# Altium project S7CAS-PLEIADES-CARTES-MERE_P07.PrjPcb (part 2 of 4)

## Sheet S7CAS-PLEIADES-CARTE-MERE_P07_FPGA_2.SchDoc
size Tabloid; DocumentNumber: 6; SheetNumber: 6; SheetTotal: 16; Sheet_Name: FPGA_2; Size: 11x17
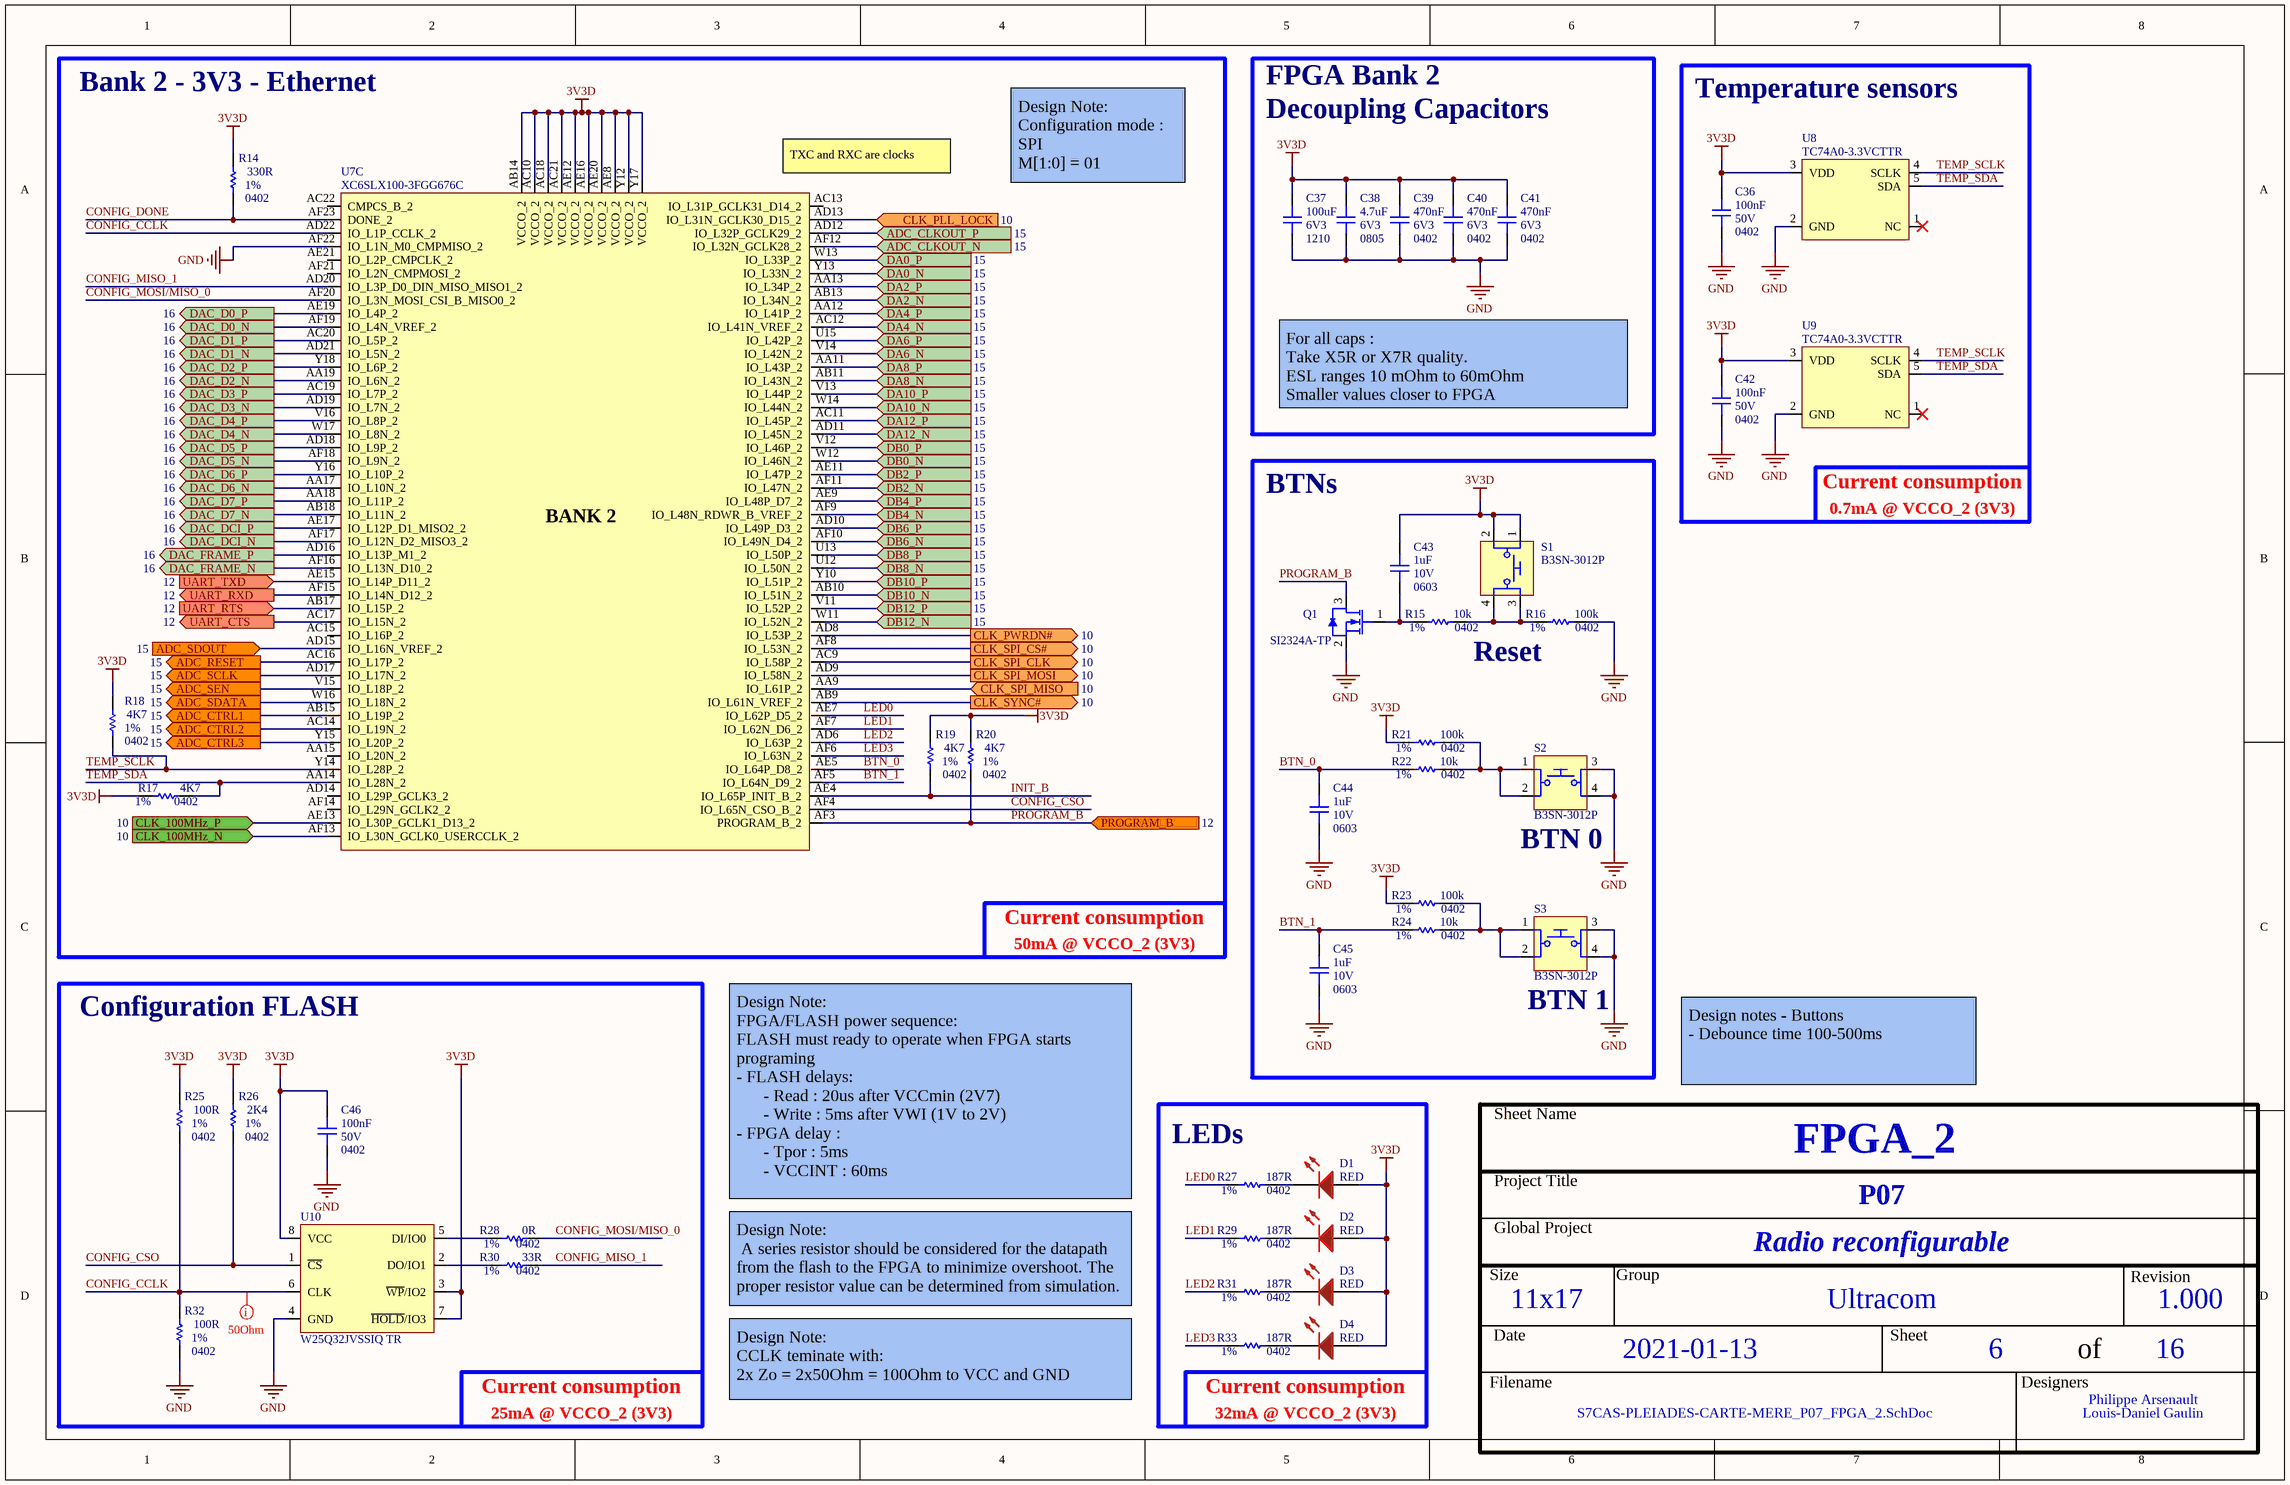
[diagram p5: S7CAS-PLEIADES-CARTE-MERE_P07_FPGA_2.SchDoc]

### Parts
C36  value 100nF  Voltage: 50V  Package: 0402  [CAP_0402]  (hidden comment: CAP - 0402)
C37  value 100uF  Voltage: 6V3  Package: 1210  [CAP_1210]  (hidden comment: CAP - 1210)
C38  value 4.7uF  Voltage: 6V3  Package: 0805  [CAP_0805]  (hidden comment: CAP - 0805)
C39  value 470nF  Voltage: 6V3  Package: 0402  [CAP_0402]  (hidden comment: CAP - 0402)
C40  value 470nF  Voltage: 6V3  Package: 0402  [CAP_0402]  (hidden comment: CAP - 0402)
C41  value 470nF  Voltage: 6V3  Package: 0402  [CAP_0402]  (hidden comment: CAP - 0402)
C42  value 100nF  Voltage: 50V  Package: 0402  [CAP_0402]  (hidden comment: CAP - 0402)
C43  value 1uF  Voltage: 10V  Package: 0603  [CAP_0603]  (hidden comment: CAP - 0603)
C44  value 1uF  Voltage: 10V  Package: 0603  [CAP_0603]  (hidden comment: CAP - 0603)
C45  value 1uF  Voltage: 10V  Package: 0603  [CAP_0603]  (hidden comment: CAP - 0603)
C46  value 100nF  Voltage: 50V  Package: 0402  [CAP_0402]  (hidden comment: CAP - 0402)
D1  value RED  [LED_0603]  (hidden comment: SML-311UTT86)
D2  value RED  [LED_0603]  (hidden comment: SML-311UTT86)
D3  value RED  [LED_0603]  (hidden comment: SML-311UTT86)
D4  value RED  [LED_0603]  (hidden comment: SML-311UTT86)
Q1  SI2324A-TP  [TRX_NMOS_SI324A-TP]
R14  value 330R  Package: 0402  Precision: 1%  [RES_0402]  (hidden comment: RES - 0402)
R15  value 10k  Package: 0402  Precision: 1%  [RES_0402]  (hidden comment: RES - 0402)
R16  value 100k  Package: 0402  Precision: 1%  [RES_0402]  (hidden comment: RES - 0402)
R17  value 4K7  Package: 0402  Precision: 1%  [RES_0402]  (hidden comment: RES - 0402)
R18  value 4K7  Package: 0402  Precision: 1%  [RES_0402]  (hidden comment: RES - 0402)
R19  value 4K7  Package: 0402  Precision: 1%  [RES_0402]  (hidden comment: RES - 0402)
R20  value 4K7  Package: 0402  Precision: 1%  [RES_0402]  (hidden comment: RES - 0402)
R21  value 100k  Package: 0402  Precision: 1%  [RES_0402]  (hidden comment: RES - 0402)
R22  value 10k  Package: 0402  Precision: 1%  [RES_0402]  (hidden comment: RES - 0402)
R23  value 100k  Package: 0402  Precision: 1%  [RES_0402]  (hidden comment: RES - 0402)
R24  value 10k  Package: 0402  Precision: 1%  [RES_0402]  (hidden comment: RES - 0402)
R25  value 100R  Package: 0402  Precision: 1%  [RES_0402]  (hidden comment: RES - 0402)
R26  value 2K4  Package: 0402  Precision: 1%  [RES_0402]  (hidden comment: RES - 0402)
R27  value 187R  Package: 0402  Precision: 1%  [RES_0402]  (hidden comment: RES - 0402)
R28  value 0R  Package: 0402  Precision: 1%  [RES_0402]  (hidden comment: RES - 0402)
R29  value 187R  Package: 0402  Precision: 1%  [RES_0402]  (hidden comment: RES - 0402)
R30  value 33R  Package: 0402  Precision: 1%  [RES_0402]  (hidden comment: RES - 0402)
R31  value 187R  Package: 0402  Precision: 1%  [RES_0402]  (hidden comment: RES - 0402)
R32  value 100R  Package: 0402  Precision: 1%  [RES_0402]  (hidden comment: RES - 0402)
R33  value 187R  Package: 0402  Precision: 1%  [RES_0402]  (hidden comment: RES - 0402)
S1  B3SN-3012P  [SWI_TACT_B3SN-3012P]
S2  B3SN-3012P  [SWI_TACT_B3SN-3012P]
S3  B3SN-3012P  [SWI_TACT_B3SN-3012P]
U7  XC6SLX100-3FGG676C  [FPGA_XILINX_FGG676]  (part C of 10)
U8  TC74A0-3.3VCTTR  [SEN_TEMP_TC74A0-3.3VCTTR]
U9  TC74A0-3.3VCTTR  [SEN_TEMP_TC74A0-3.3VCTTR]
U10  W25Q32JVSSIQ TR  [MEM_FLASH_W25Q32JVSSIQ TR]

### Blocks framed on the sheet
Bank 2 - 3V3 - Ethernet: R14 R17-R20 U7
Temperature sensors: C36 C42 U8 U9
Configuration FLASH: C46 R25 R26 R28 R30 R32 U10
LEDs: D1-D4 R27 R29 R31 R33

### Ports
ADC_CLKOUT_N (in, see 15), ADC_CLKOUT_P (in, see 15), ADC_CTRL1 (out, see 15), ADC_CTRL2 (out, see 15), ADC_CTRL3 (out, see 15), ADC_RESET (out, see 15), ADC_SCLK (out, see 15), ADC_SDATA (out, see 15), ADC_SDOUT (in, see 15), ADC_SEN (out, see 15), CLK_100MHz_N (in, see 10), CLK_100MHz_P (in, see 10), CLK_PLL_LOCK (in, see 10), CLK_PWRDN# (out, see 10), CLK_SPI_CLK (out, see 10), CLK_SPI_CS# (out, see 10), CLK_SPI_MISO (in, see 10), CLK_SPI_MOSI (out, see 10), CLK_SYNC# (out, see 10), DA0_N (in, see 15), DA0_P (in, see 15), DA2_N (in, see 15), DA2_P (in, see 15), DA4_N (in, see 15), DA4_P (in, see 15), DA6_N (in, see 15), DA6_P (in, see 15), DA8_N (in, see 15), DA8_P (in, see 15), DA10_N (in, see 15), DA10_P (in, see 15), DA12_N (in, see 15), DA12_P (in, see 15), DAC_D0_N (out, see 16), DAC_D0_P (out, see 16), DAC_D1_N (out, see 16), DAC_D1_P (out, see 16), DAC_D2_N (out, see 16), DAC_D2_P (out, see 16), DAC_D3_N (out, see 16), DAC_D3_P (out, see 16), DAC_D4_N (out, see 16), DAC_D4_P (out, see 16), DAC_D5_N (out, see 16), DAC_D5_P (out, see 16), DAC_D6_N (out, see 16), DAC_D6_P (out, see 16), DAC_D7_N (out, see 16), DAC_D7_P (out, see 16), DAC_DCI_N (out, see 16), DAC_DCI_P (out, see 16), DAC_FRAME_N (out, see 16), DAC_FRAME_P (out, see 16), DB0_N (in, see 15), DB0_P (in, see 15), DB2_N (in, see 15), DB2_P (in, see 15), DB4_N (in, see 15), DB4_P (in, see 15), DB6_N (in, see 15), DB6_P (in, see 15), DB8_N (in, see 15), DB8_P (in, see 15), DB10_N (in, see 15), DB10_P (in, see 15), DB12_N (in, see 15), DB12_P (in, see 15), PROGRAM_B (in, see 12), UART_CTS (out, see 12), UART_RTS (in, see 12), UART_RXD (out, see 12), UART_TXD (in, see 12)

### Nets
3V3D: C36.2 C37.2 C38.2 C39.2 C40.2 C41.2 C42.2 C43.2 C46.2 D1.A D2.A D3.A D4.A R14.2 R17.1 R18.2 R19.2 R20.2 R21.1 R23.1 R25.2 R26.2 S1.1 S1.2 U7.AB14(VCCO_2) U7.AC10(VCCO_2) U7.AC18(VCCO_2) U7.AC21(VCCO_2) U7.AE8(VCCO_2) U7.AE12(VCCO_2) U7.AE16(VCCO_2) U7.AE20(VCCO_2) U7.Y12(VCCO_2) U7.Y17(VCCO_2) U8.3(VDD) U9.3(VDD) U10.3(~{WP}/IO2) U10.7(~{HOLD}/IO3) U10.8(VCC)
GND: C36.1 C37.1 C38.1 C39.1 C40.1 C41.1 C42.1 C44.1 C45.1 C46.1 Q1.2(S) R16.2 R32.1 S2.3 S2.4 S3.3 S3.4 U7.AF22(IO_L1N_M0_CMPMISO_2) U8.2(GND) U9.2(GND) U10.4(GND)
ADC_CLKOUT_N: U7.AF12(IO_L32N_GCLK28_2) ; port ADC_CLKOUT_N
ADC_CLKOUT_P: U7.AD12(IO_L32P_GCLK29_2) ; port ADC_CLKOUT_P
ADC_CTRL1: U7.AB15(IO_L19P_2) ; port ADC_CTRL1
ADC_CTRL2: U7.AC14(IO_L19N_2) ; port ADC_CTRL2
ADC_CTRL3: U7.Y15(IO_L20P_2) ; port ADC_CTRL3
ADC_RESET: U7.AC16(IO_L17P_2) ; port ADC_RESET
ADC_SCLK: U7.AD17(IO_L17N_2) ; port ADC_SCLK
ADC_SDATA: U7.W16(IO_L18N_2) ; port ADC_SDATA
ADC_SDOUT: U7.AD15(IO_L16N_VREF_2) ; port ADC_SDOUT
ADC_SEN: U7.V15(IO_L18P_2) ; port ADC_SEN
BTN_0: C44.2 R22.1 U7.AE5(IO_L64P_D8_2)
BTN_1: C45.2 R24.1 U7.AF5(IO_L64N_D9_2)
CLK_100MHz_N: U7.AF13(IO_L30N_GCLK0_USERCCLK_2) ; port CLK_100MHz_N
CLK_100MHz_P: U7.AE13(IO_L30P_GCLK1_D13_2) ; port CLK_100MHz_P
CLK_PLL_LOCK: U7.AD13(IO_L31N_GCLK30_D15_2) ; port CLK_PLL_LOCK
CLK_PWRDN#: U7.AD8(IO_L53P_2) ; port CLK_PWRDN#
CLK_SPI_CLK: U7.AC9(IO_L58P_2) ; port CLK_SPI_CLK
CLK_SPI_CS#: U7.AF8(IO_L53N_2) ; port CLK_SPI_CS#
CLK_SPI_MISO: U7.AA9(IO_L61P_2) ; port CLK_SPI_MISO
CLK_SPI_MOSI: U7.AD9(IO_L58N_2) ; port CLK_SPI_MOSI
CLK_SYNC#: U7.AB9(IO_L61N_VREF_2) ; port CLK_SYNC#
CONFIG_CCLK: R25.1 R32.2 U7.AD22(IO_L1P_CCLK_2) U10.6(CLK)
CONFIG_CSO: R26.1 U7.AF4(IO_L65N_CSO_B_2) U10.1(~{CS})
CONFIG_DONE: R14.1 U7.AF23(DONE_2)
CONFIG_MISO_1: R30.1 U7.AD20(IO_L3P_D0_DIN_MISO_MISO1_2)
CONFIG_MOSI/MISO_0: R28.1 U7.AF20(IO_L3N_MOSI_CSI_B_MISO0_2)
DA0_N: U7.Y13(IO_L33N_2) ; port DA0_N
DA0_P: U7.W13(IO_L33P_2) ; port DA0_P
DA2_N: U7.AB13(IO_L34N_2) ; port DA2_N
DA2_P: U7.AA13(IO_L34P_2) ; port DA2_P
DA4_N: U7.AC12(IO_L41N_VREF_2) ; port DA4_N
DA4_P: U7.AA12(IO_L41P_2) ; port DA4_P
DA6_N: U7.V14(IO_L42N_2) ; port DA6_N
DA6_P: U7.U15(IO_L42P_2) ; port DA6_P
DA8_N: U7.AB11(IO_L43N_2) ; port DA8_N
DA8_P: U7.AA11(IO_L43P_2) ; port DA8_P
DA10_N: U7.W14(IO_L44N_2) ; port DA10_N
DA10_P: U7.V13(IO_L44P_2) ; port DA10_P
DA12_N: U7.AD11(IO_L45N_2) ; port DA12_N
DA12_P: U7.AC11(IO_L45P_2) ; port DA12_P
DAC_D0_N: U7.AF19(IO_L4N_VREF_2) ; port DAC_D0_N
DAC_D0_P: U7.AE19(IO_L4P_2) ; port DAC_D0_P
DAC_D1_N: U7.AD21(IO_L5N_2) ; port DAC_D1_N
DAC_D1_P: U7.AC20(IO_L5P_2) ; port DAC_D1_P
DAC_D2_N: U7.AA19(IO_L6N_2) ; port DAC_D2_N
DAC_D2_P: U7.Y18(IO_L6P_2) ; port DAC_D2_P
DAC_D3_N: U7.AD19(IO_L7N_2) ; port DAC_D3_N
DAC_D3_P: U7.AC19(IO_L7P_2) ; port DAC_D3_P
DAC_D4_N: U7.W17(IO_L8N_2) ; port DAC_D4_N
DAC_D4_P: U7.V16(IO_L8P_2) ; port DAC_D4_P
DAC_D5_N: U7.AF18(IO_L9N_2) ; port DAC_D5_N
DAC_D5_P: U7.AD18(IO_L9P_2) ; port DAC_D5_P
DAC_D6_N: U7.AA17(IO_L10N_2) ; port DAC_D6_N
DAC_D6_P: U7.Y16(IO_L10P_2) ; port DAC_D6_P
DAC_D7_N: U7.AB18(IO_L11N_2) ; port DAC_D7_N
DAC_D7_P: U7.AA18(IO_L11P_2) ; port DAC_D7_P
DAC_DCI_N: U7.AF17(IO_L12N_D2_MISO3_2) ; port DAC_DCI_N
DAC_DCI_P: U7.AE17(IO_L12P_D1_MISO2_2) ; port DAC_DCI_P
DAC_FRAME_N: U7.AF16(IO_L13N_D10_2) ; port DAC_FRAME_N
DAC_FRAME_P: U7.AD16(IO_L13P_M1_2) ; port DAC_FRAME_P
DB0_N: U7.W12(IO_L46N_2) ; port DB0_N
DB0_P: U7.V12(IO_L46P_2) ; port DB0_P
DB2_N: U7.AF11(IO_L47N_2) ; port DB2_N
DB2_P: U7.AE11(IO_L47P_2) ; port DB2_P
DB4_N: U7.AF9(IO_L48N_RDWR_B_VREF_2) ; port DB4_N
DB4_P: U7.AE9(IO_L48P_D7_2) ; port DB4_P
DB6_N: U7.AF10(IO_L49N_D4_2) ; port DB6_N
DB6_P: U7.AD10(IO_L49P_D3_2) ; port DB6_P
DB8_N: U7.U12(IO_L50N_2) ; port DB8_N
DB8_P: U7.U13(IO_L50P_2) ; port DB8_P
DB10_N: U7.AB10(IO_L51N_2) ; port DB10_N
DB10_P: U7.Y10(IO_L51P_2) ; port DB10_P
DB12_N: U7.W11(IO_L52N_2) ; port DB12_N
DB12_P: U7.V11(IO_L52P_2) ; port DB12_P
INIT_B: R19.1 U7.AE4(IO_L65P_INIT_B_2)
LED0: R27.1 U7.AE7(IO_L62P_D5_2)
LED1: R29.1 U7.AF7(IO_L62N_D6_2)
LED2: R31.1 U7.AD6(IO_L63P_2)
LED3: R33.1 U7.AF6(IO_L63N_2)
PROGRAM_B: Q1.3(D) R20.1 U7.AF3(PROGRAM_B_2) ; port PROGRAM_B
TEMP_SCLK: R18.1 U7.Y14(IO_L28P_2) U8.4(SCLK) U9.4(SCLK)
TEMP_SDA: R17.2 U7.AA14(IO_L28N_2) U8.5(SDA) U9.5(SDA)
UART_CTS: U7.AC17(IO_L15N_2) ; port UART_CTS
UART_RTS: U7.AB17(IO_L15P_2) ; port UART_RTS
UART_RXD: U7.AF15(IO_L14N_D12_2) ; port UART_RXD
UART_TXD: U7.AE15(IO_L14P_D11_2) ; port UART_TXD
NetC43_1: C43.1 Q1.1(G) R15.1
NetD1_K: D1.K R27.2
NetD2_K: D2.K R29.2
NetD3_K: D3.K R31.2
NetD4_K: D4.K R33.2
NetR15_2: R15.2 R16.1 S1.3 S1.4
NetR21_2: R21.2 R22.2 S2.1 S2.2
NetR23_2: R23.2 R24.2 S3.1 S3.2
NetR28_2: R28.2 U10.5(DI/IO0)
NetR30_2: R30.2 U10.2(DO/IO1)

Not connected (* = marked no-connect by the designer): U7 AA15(IO_L20N_2) AC13(IO_L31P_GCLK31_D14_2) AC15(IO_L16P_2) AC22(CMPCS_B_2) AD14(IO_L29P_GCLK3_2) AE21(IO_L2P_CMPCLK_2) AF14(IO_L29N_GCLK2_2) AF21(IO_L2N_CMPMOSI_2); U8 1(NC)*; U9 1(NC)*

### Layout directives
net class SE_50Ohm: CONFIG_CCLK

### Notes on the sheet
- FPGA Bank 2
- (near U7) TXC and RXC are clocks
- Decoupling Capacitors
- Design Note:
  Configuration mode : SPI
  M[1:0] = 01
- For all caps :
  Take X5R or X7R quality.
  ESL ranges 10 mOhm to 60mOhm
  Smaller values closer to FPGA
- BTNs
- Current consumption
- 0.7mA @ VCCO_2 (3V3)
- Reset
- (near S2) BTN 0
- 50mA @ VCCO_2 (3V3)
- (near S3) BTN 1
- Design notes - Buttons
  - Debounce time 100-500ms
- Design Note:
  FPGA/FLASH power sequence:
  FLASH must ready to operate when FPGA starts programing
  - FLASH delays:
  - Read : 20us after VCCmin (2V7)
  - Write : 5ms after VWI (1V to 2V)
  - FPGA delay :
  - Tpor : 5ms
  - VCCINT : 60ms
- Design Note:
  A series resistor should be considered for the datapath from the flash to the FPGA to minimize overshoot. The proper resistor value can be determined from simulation.
- 25mA @ VCCO_2 (3V3)
- Design Note:
  CCLK teminate with:
  2x Zo = 2x50Ohm = 100Ohm to VCC and GND
- 32mA @ VCCO_2 (3V3)
- Sheet Name
- Project Title
- Global Project
- Size
- Group
- Revision
- Date
- Sheet
- of
- Filename
- Designers
- (in symbol FPGA_XC6SLX100-3FGG676C, part C) BANK 2

### Library data of the parts
C36 C39-C42 C46 = CAP - 0402: Precision: 10%; Current: *; CreatedBy: Jonathan Bouchard; Power: *
C37 = CAP - 1210: Precision: 10%; Current: *; CreatedBy: Jonathan Bouchard; Power: *
C38 = CAP - 0805: Precision: 10%; Current: *; CreatedBy: Jonathan Bouchard; Power: *
C43-C45 = CAP - 0603: Precision: 10%; Current: *; CreatedBy: Jonathan Bouchard; Power: *
D1-D4 = LED_SML-311UTT86: LED - 620nM RED 2mA - 0603; Voltage: 1.8V; Mfg: ROHM Semiconductor; Power: 44mW; Current: 2mA; HelpURL: http://media.digikey.com/pdf/Data%20Sheets/Rohm%20PDFs/SML-311%20Series.pdf; CreatedBy: Jonathan Bouchard; Temperature: -30°C to 85°C; Package: 0603; Precision: *; Mfg Part Number: SML-311UTT86; Supplier 1: Digikey; Supplier Part Number 1: 511-1304-1-ND
Q1 = TRX_NMOS_SI2324A-TP: TRX - MOSFET N-CH 100V 2A - SOT-23; Manufacturer #1: Micro Commercial Co; Power Max: 350mW; Voltage rating: 100V (Vds max), 2V (Vgs @ 250uA); Polarized: Yes; Magnetic Material: UNKNOWN; Current Rating: 2A; Manufacturer #2: *; Value: *; Part Number #1: SI2324A-TP; Part Number #2: *; HelpURL: https://www.mccsemi.com/pdf/Products/SI2324A(SOT-23)-A.pdf; Supplier 1: Digi-Key; Supplier Part Number 1: SI2324A-TPMSCT-ND; Assembly Type: SMD; Temperature: -55°C ~ 150°C (TJ); Package: SOT-23; CreatedBy/Date: *; GRAMS Lib Spec: *; Tolerance: *; VerifiedBy: *; Cryo: *
R14-R33 = RES - 0402: Voltage: 50V; Power: 1/16W; Current: *; CreatedBy: Jonathan Bouchard
S1-S3 = SWI_TACT_B3SN-3012P_1: SWI - SWITCH TACTILE SPST-NO 0.05A 24V -SMD; Manufacturer #1: Omron Electronics Inc-EMC Div; Current Rating: 50mA; Voltage rating: 24VDC; Polarized: No; Magnetic Material: UNKNOWN; GRAMS Lib Spec: 2.8; Manufacturer #2: *; Power Max: *; Value: SPST-NO; Part Number #1: B3SN-3012P; Part Number #2: *; HelpURL: http://omronfs.omron.com/en_US/ecb/products/pdf/en-b3sn.pdf; Supplier 1: Digi-Key; Supplier Part Number 1: SW261CT-ND; Assembly Type: SMD; Temperature: -25°C ~ 70°C; Package: SMD; CreatedBy/Date: Olivier Bernard / 5/12/2017; Tolerance: *; VerifiedBy: Caroline Paulin / 11 juillet 2018; Cryo: UNKNOWN
U7 = FPGA_XC6SLX100-3FGG676C: as U7 on sheet S7CAS-PLEIADES-CARTE-MERE_P07_FPGA_0; Current: *; Power: *; Mfg: Xilinx; Mfg Part Number: XC6SLX100-3FGG676C; HelpURL: https://www.xilinx.com/support/documentation/data_sheets/ds162.pdf; CreatedBy: Jonathan Bouchard; Temperature: 0°C ~ 85°C (TJ); Value: *; Precision: *; Package: BGA-676; Supplier 1: Digikey; Supplier Part Number 1: 122-1760-ND
U8 U9 = SENS_TEMP_TC74A0-3.3VCTTR: SENS - TEMPERATURE SENSOR I2C/SMBUS - SOT23-5; Voltage: 2.7 V ~ 5.5 V; Mfg: Microchip; Precision: ±2°C (±3°C); Current: *; Power: *; Mfg Part Number: TC74A0-3.3VCTTR; HelpURL: http://ww1.microchip.com/downloads/en/DeviceDoc/21462D.pdf; CreatedBy: Jonathan Bouchard; Temperature: -40°C ~ 125°C; Value: *; Package: SOT23-5; Supplier 1: Digikey; Supplier Part Number 1: TC74A0-3.3VCTDKR-ND
U10 = MEM_FLASH_W25Q32JVSSIQ TR: MEM - FLASH NOR 32Mb 133MHZ - 8-SOIC; Voltage: 2.7 V ~ 3.6 V; Mfg: Winbond Electronics; Current: *; Power: *; Mfg Part Number: W25Q32JVSSIQ TR; HelpURL: https://www.winbond.com/resource-files/w25q32jv%20revg%2003272018%20plus.pdf; CreatedBy: Louis-Daniel Gaulin; Temperature: -40°C ~ 85°C (TA); Value: *; Precision: *; Package: 8-SOIC; Supplier Part Number 1: W25Q32JVSSIQCT-ND; Supplier 1: Digikey

## Sheet S7CAS-PLEIADES-CARTE-MERE_P07_FPGA_3.SchDoc
size Tabloid; DocumentNumber: 7; SheetNumber: 7; SheetTotal: 16; Sheet_Name: FPGA_3; Size: 11x17
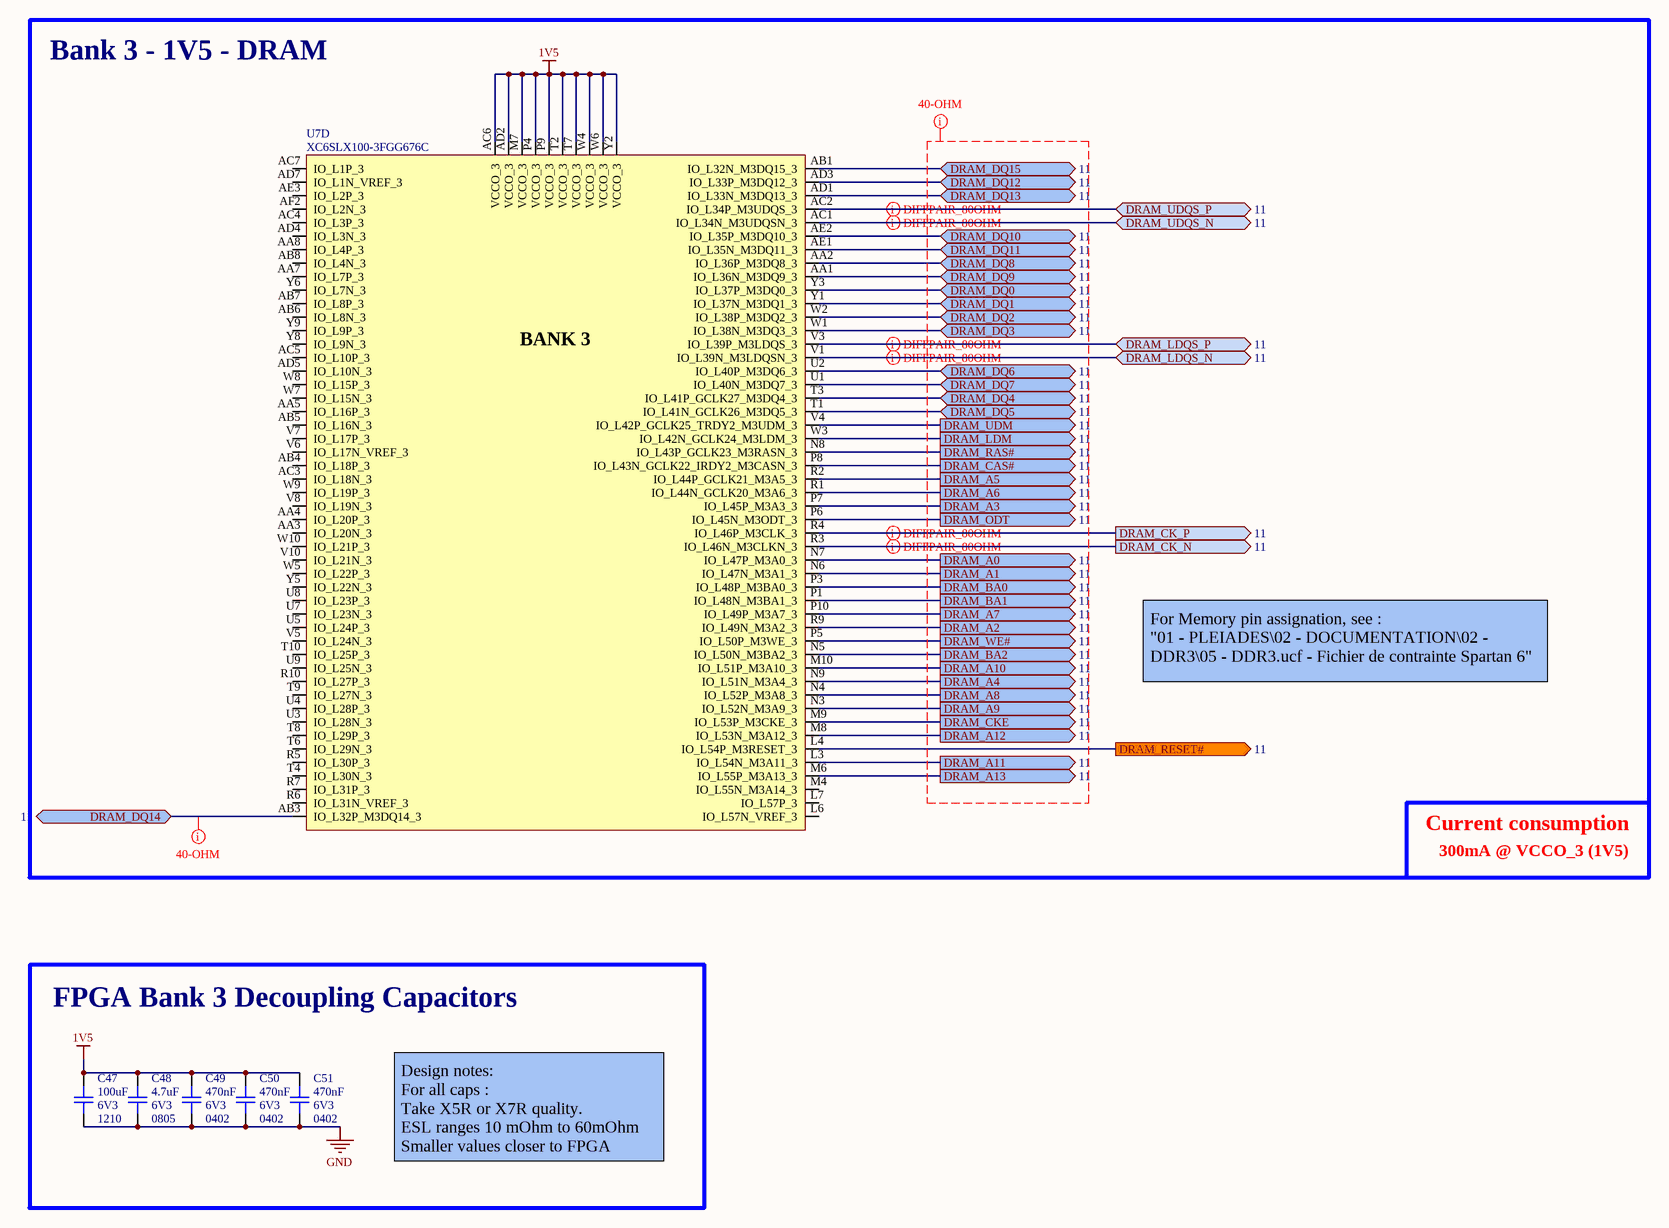
[diagram p6: S7CAS-PLEIADES-CARTE-MERE_P07_FPGA_3.SchDoc]

### Parts
C47  value 100uF  Voltage: 6V3  Package: 1210  [CAP_1210]  (hidden comment: CAP - 1210)
C48  value 4.7uF  Voltage: 6V3  Package: 0805  [CAP_0805]  (hidden comment: CAP - 0805)
C49  value 470nF  Voltage: 6V3  Package: 0402  [CAP_0402]  (hidden comment: CAP - 0402)
C50  value 470nF  Voltage: 6V3  Package: 0402  [CAP_0402]  (hidden comment: CAP - 0402)
C51  value 470nF  Voltage: 6V3  Package: 0402  [CAP_0402]  (hidden comment: CAP - 0402)
U7  XC6SLX100-3FGG676C  [FPGA_XILINX_FGG676]  (part D of 10)

### Blocks framed on the sheet
Bank 3 - 1V5 - DRAM: U7
FPGA Bank 3 Decoupling Capacitors: C47-C51

### Ports
DRAM_A0 (out, see 11), DRAM_A1 (out, see 11), DRAM_A2 (out, see 11), DRAM_A3 (out, see 11), DRAM_A4 (out, see 11), DRAM_A5 (out, see 11), DRAM_A6 (out, see 11), DRAM_A7 (out, see 11), DRAM_A8 (out, see 11), DRAM_A9 (out, see 11), DRAM_A10 (out, see 11), DRAM_A11 (out, see 11), DRAM_A12 (out, see 11), DRAM_A13 (out, see 11), DRAM_BA0 (out, see 11), DRAM_BA1 (out, see 11), DRAM_BA2 (out, see 11), DRAM_CAS# (out, see 11), DRAM_CK_N (out, see 11), DRAM_CK_P (out, see 11), DRAM_CKE (out, see 11), DRAM_DQ0 (bidir, see 11), DRAM_DQ1 (bidir, see 11), DRAM_DQ2 (bidir, see 11), DRAM_DQ3 (bidir, see 11), DRAM_DQ4 (bidir, see 11), DRAM_DQ5 (bidir, see 11), DRAM_DQ6 (bidir, see 11), DRAM_DQ7 (bidir, see 11), DRAM_DQ8 (bidir, see 11), DRAM_DQ9 (bidir, see 11), DRAM_DQ10 (bidir, see 11), DRAM_DQ11 (bidir, see 11), DRAM_DQ12 (bidir, see 11), DRAM_DQ13 (bidir, see 11), DRAM_DQ14 (bidir, see 11), DRAM_DQ15 (bidir, see 11), DRAM_LDM (out, see 11), DRAM_LDQS_N (bidir, see 11), DRAM_LDQS_P (bidir, see 11), DRAM_ODT (out, see 11), DRAM_RAS# (out, see 11), DRAM_RESET# (out, see 11), DRAM_UDM (out, see 11), DRAM_UDQS_N (bidir, see 11), DRAM_UDQS_P (bidir, see 11), DRAM_WE# (out, see 11)

### Nets
1V5: C47.2 C48.2 C49.2 C50.2 C51.2 U7.AC6(VCCO_3) U7.AD2(VCCO_3) U7.M7(VCCO_3) U7.P4(VCCO_3) U7.P9(VCCO_3) U7.T2(VCCO_3) U7.T7(VCCO_3) U7.W4(VCCO_3) U7.W6(VCCO_3) U7.Y2(VCCO_3)
GND: C47.1 C48.1 C49.1 C50.1 C51.1
DRAM_A0: U7.N7(IO_L47P_M3A0_3) ; port DRAM_A0
DRAM_A1: U7.N6(IO_L47N_M3A1_3) ; port DRAM_A1
DRAM_A2: U7.R9(IO_L49N_M3A2_3) ; port DRAM_A2
DRAM_A3: U7.P7(IO_L45P_M3A3_3) ; port DRAM_A3
DRAM_A4: U7.N9(IO_L51N_M3A4_3) ; port DRAM_A4
DRAM_A5: U7.R2(IO_L44P_GCLK21_M3A5_3) ; port DRAM_A5
DRAM_A6: U7.R1(IO_L44N_GCLK20_M3A6_3) ; port DRAM_A6
DRAM_A7: U7.P10(IO_L49P_M3A7_3) ; port DRAM_A7
DRAM_A8: U7.N4(IO_L52P_M3A8_3) ; port DRAM_A8
DRAM_A9: U7.N3(IO_L52N_M3A9_3) ; port DRAM_A9
DRAM_A10: U7.M10(IO_L51P_M3A10_3) ; port DRAM_A10
DRAM_A11: U7.L3(IO_L54N_M3A11_3) ; port DRAM_A11
DRAM_A12: U7.M8(IO_L53N_M3A12_3) ; port DRAM_A12
DRAM_A13: U7.M6(IO_L55P_M3A13_3) ; port DRAM_A13
DRAM_BA0: U7.P3(IO_L48P_M3BA0_3) ; port DRAM_BA0
DRAM_BA1: U7.P1(IO_L48N_M3BA1_3) ; port DRAM_BA1
DRAM_BA2: U7.N5(IO_L50N_M3BA2_3) ; port DRAM_BA2
DRAM_CAS#: U7.P8(IO_L43N_GCLK22_IRDY2_M3CASN_3) ; port DRAM_CAS#
DRAM_CK_N: U7.R3(IO_L46N_M3CLKN_3) ; port DRAM_CK_N
DRAM_CK_P: U7.R4(IO_L46P_M3CLK_3) ; port DRAM_CK_P
DRAM_CKE: U7.M9(IO_L53P_M3CKE_3) ; port DRAM_CKE
DRAM_DQ0: U7.Y3(IO_L37P_M3DQ0_3) ; port DRAM_DQ0
DRAM_DQ1: U7.Y1(IO_L37N_M3DQ1_3) ; port DRAM_DQ1
DRAM_DQ2: U7.W2(IO_L38P_M3DQ2_3) ; port DRAM_DQ2
DRAM_DQ3: U7.W1(IO_L38N_M3DQ3_3) ; port DRAM_DQ3
DRAM_DQ4: U7.T3(IO_L41P_GCLK27_M3DQ4_3) ; port DRAM_DQ4
DRAM_DQ5: U7.T1(IO_L41N_GCLK26_M3DQ5_3) ; port DRAM_DQ5
DRAM_DQ6: U7.U2(IO_L40P_M3DQ6_3) ; port DRAM_DQ6
DRAM_DQ7: U7.U1(IO_L40N_M3DQ7_3) ; port DRAM_DQ7
DRAM_DQ8: U7.AA2(IO_L36P_M3DQ8_3) ; port DRAM_DQ8
DRAM_DQ9: U7.AA1(IO_L36N_M3DQ9_3) ; port DRAM_DQ9
DRAM_DQ10: U7.AE2(IO_L35P_M3DQ10_3) ; port DRAM_DQ10
DRAM_DQ11: U7.AE1(IO_L35N_M3DQ11_3) ; port DRAM_DQ11
DRAM_DQ12: U7.AD3(IO_L33P_M3DQ12_3) ; port DRAM_DQ12
DRAM_DQ13: U7.AD1(IO_L33N_M3DQ13_3) ; port DRAM_DQ13
DRAM_DQ14: U7.AB3(IO_L32P_M3DQ14_3) ; port DRAM_DQ14
DRAM_DQ15: U7.AB1(IO_L32N_M3DQ15_3) ; port DRAM_DQ15
DRAM_LDM: U7.W3(IO_L42N_GCLK24_M3LDM_3) ; port DRAM_LDM
DRAM_LDQS_N: U7.V1(IO_L39N_M3LDQSN_3) ; port DRAM_LDQS_N
DRAM_LDQS_P: U7.V3(IO_L39P_M3LDQS_3) ; port DRAM_LDQS_P
DRAM_ODT: U7.P6(IO_L45N_M3ODT_3) ; port DRAM_ODT
DRAM_RAS#: U7.N8(IO_L43P_GCLK23_M3RASN_3) ; port DRAM_RAS#
DRAM_RESET#: U7.L4(IO_L54P_M3RESET_3) ; port DRAM_RESET#
DRAM_UDM: U7.V4(IO_L42P_GCLK25_TRDY2_M3UDM_3) ; port DRAM_UDM
DRAM_UDQS_N: U7.AC1(IO_L34N_M3UDQSN_3) ; port DRAM_UDQS_N
DRAM_UDQS_P: U7.AC2(IO_L34P_M3UDQS_3) ; port DRAM_UDQS_P
DRAM_WE#: U7.P5(IO_L50P_M3WE_3) ; port DRAM_WE#

Not connected (* = marked no-connect by the designer): U7 AA3(IO_L20N_3) AA4(IO_L20P_3) AA5(IO_L16P_3) AA7(IO_L7P_3) AA8(IO_L4P_3) AB4(IO_L18P_3) AB5(IO_L16N_3) AB6(IO_L8N_3) AB7(IO_L8P_3) AB8(IO_L4N_3) AC3(IO_L18N_3) AC4(IO_L3P_3) AC5(IO_L10P_3) AC7(IO_L1P_3) AD4(IO_L3N_3) AD5(IO_L10N_3) AD7(IO_L1N_VREF_3) AE3(IO_L2P_3) AF2(IO_L2N_3) L6(IO_L57N_VREF_3) L7(IO_L57P_3) M4(IO_L55N_M3A14_3) R5(IO_L30P_3) R6(IO_L31N_VREF_3) R7(IO_L31P_3) R10(IO_L27P_3) T4(IO_L30N_3) T6(IO_L29N_3) T8(IO_L29P_3) T9(IO_L27N_3) T10(IO_L25P_3) U3(IO_L28N_3) U4(IO_L28P_3) U5(IO_L24P_3) U7(IO_L23N_3) U8(IO_L23P_3) U9(IO_L25N_3) V5(IO_L24N_3) V6(IO_L17N_VREF_3) V7(IO_L17P_3) V8(IO_L19N_3) V10(IO_L21N_3) W5(IO_L22P_3) W7(IO_L15N_3) W8(IO_L15P_3) W9(IO_L19P_3) W10(IO_L21P_3) Y5(IO_L22N_3) Y6(IO_L7N_3) Y8(IO_L9N_3) Y9(IO_L9P_3)

### Layout directives
differential pair; differential pair class DIFF_80_OHM: DRAM_CK_N, DRAM_CK_P, DRAM_LDQS_N, DRAM_LDQS_P, DRAM_UDQS_N, DRAM_UDQS_P
net class SE_40OHM: (no net found under the mark), DRAM_DQ14

### Notes on the sheet
- For Memory pin assignation, see :
  "01 - PLEIADES\02 - DOCUMENTATION\02 - DDR3\05 - DDR3.ucf - Fichier de contrainte Spartan 6"
- Current consumption
- 300mA @ VCCO_3 (1V5)
- Design notes:
  For all caps :
  Take X5R or X7R quality.
  ESL ranges 10 mOhm to 60mOhm
  Smaller values closer to FPGA
- Sheet Name
- Project Title
- Global Project
- Size
- Group
- Revision
- Date
- Sheet
- of
- Filename
- Designers
- (in symbol FPGA_XC6SLX100-3FGG676C, part D) BANK 3

### Library data of the parts
C47 = CAP - 1210: Precision: 10%; Current: *; CreatedBy: Jonathan Bouchard; Power: *
C48 = CAP - 0805: Precision: 10%; Current: *; CreatedBy: Jonathan Bouchard; Power: *
C49-C51 = CAP - 0402: Precision: 10%; Current: *; CreatedBy: Jonathan Bouchard; Power: *
U7 = FPGA_XC6SLX100-3FGG676C: FPGA - XILINX SPARTAN 6 480 I/O - BGA-676; Voltage: 1.14 V ~ 1.26 V; Current: *; Power: *; Mfg: Xilinx; Mfg Part Number: XC6SLX100-3FGG676C; HelpURL: https://www.xilinx.com/support/documentation/data_sheets/ds162.pdf; CreatedBy: Jonathan Bouchard; Temperature: 0°C ~ 85°C (TJ); Value: *; Precision: *; Package: BGA-676; Supplier 1: Digikey; Supplier Part Number 1: 122-1760-ND

## Sheet S7CAS-PLEIADES-CARTE-MERE_P07_FPGA_4-5.SchDoc
size Tabloid; DocumentNumber: 8; SheetNumber: 8; SheetTotal: 16; Sheet_Name: FPGA_4; Size: 11x17
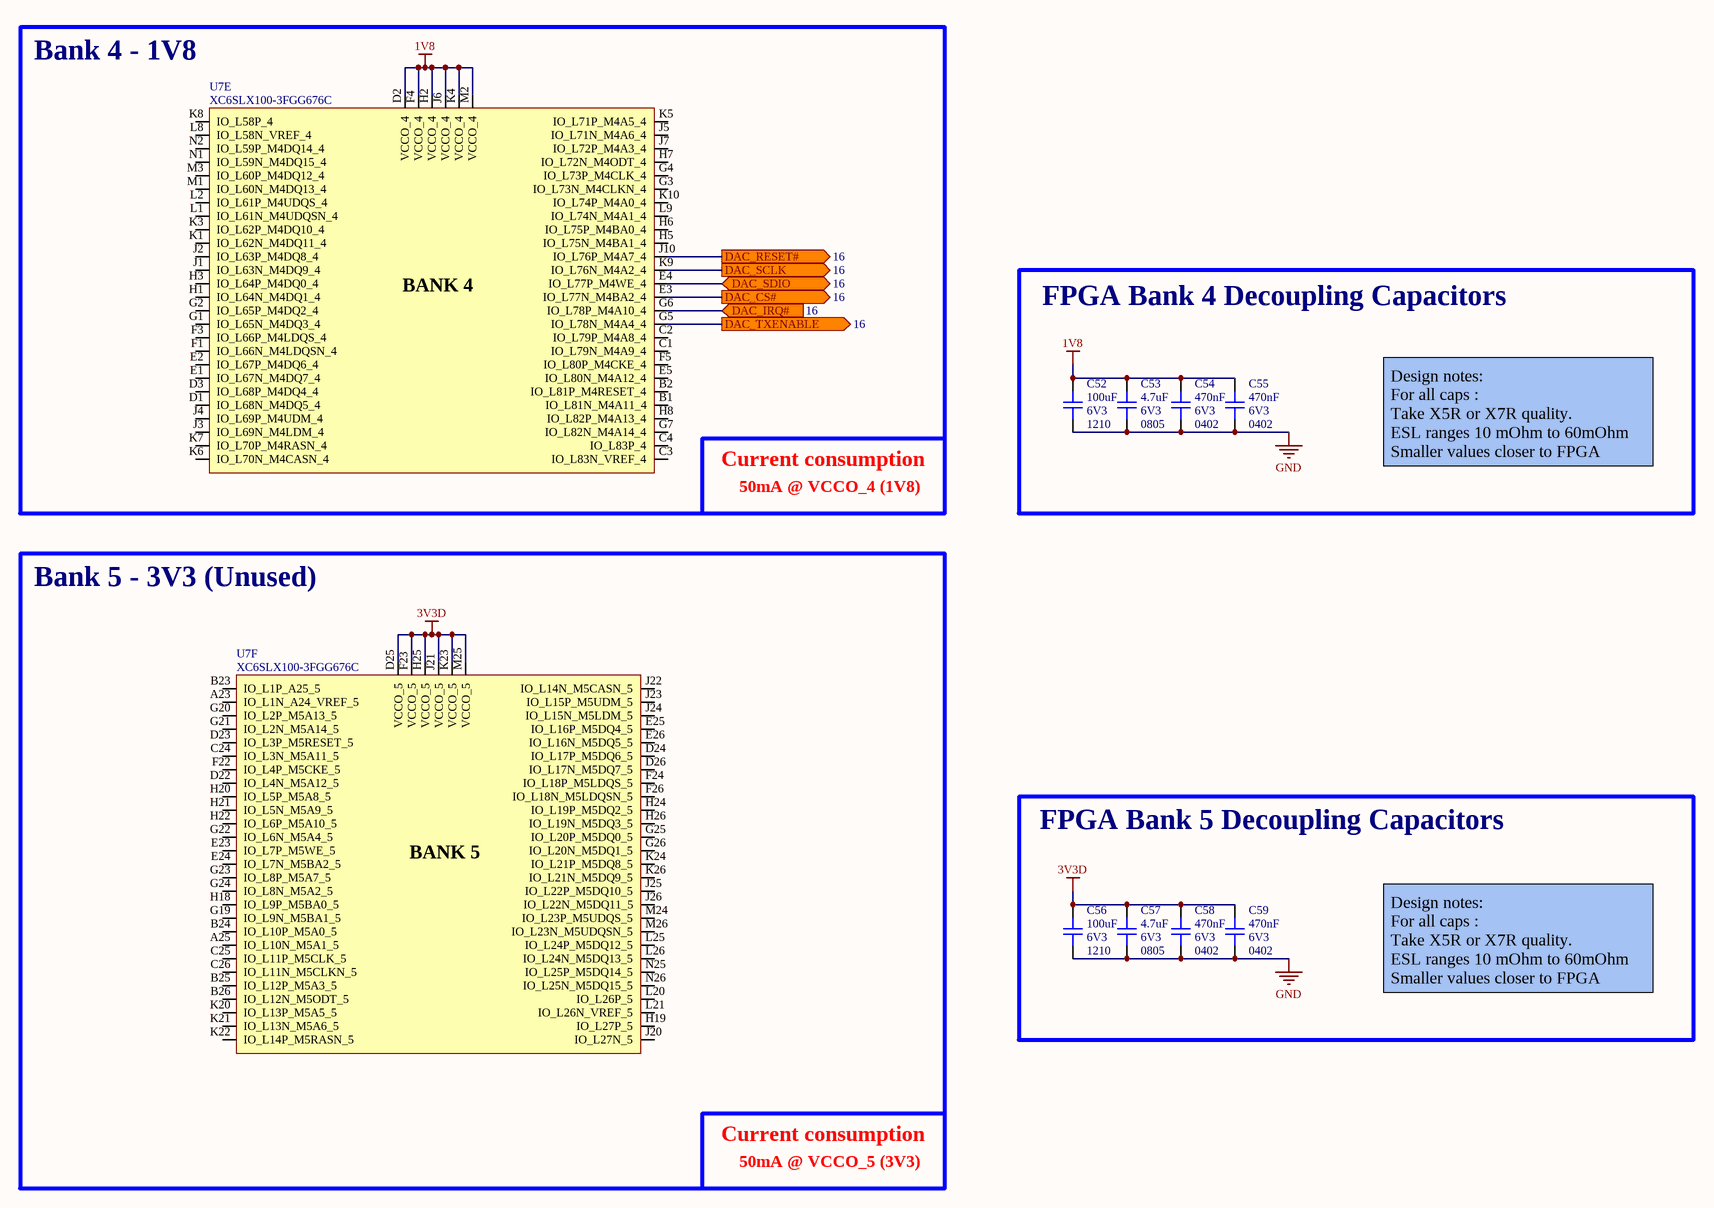
[diagram p7: S7CAS-PLEIADES-CARTE-MERE_P07_FPGA_4-5.SchDoc]

### Parts
C52  value 100uF  Voltage: 6V3  Package: 1210  [CAP_1210]  (hidden comment: CAP - 1210)
C53  value 4.7uF  Voltage: 6V3  Package: 0805  [CAP_0805]  (hidden comment: CAP - 0805)
C54  value 470nF  Voltage: 6V3  Package: 0402  [CAP_0402]  (hidden comment: CAP - 0402)
C55  value 470nF  Voltage: 6V3  Package: 0402  [CAP_0402]  (hidden comment: CAP - 0402)
C56  value 100uF  Voltage: 6V3  Package: 1210  [CAP_1210]  (hidden comment: CAP - 1210)
C57  value 4.7uF  Voltage: 6V3  Package: 0805  [CAP_0805]  (hidden comment: CAP - 0805)
C58  value 470nF  Voltage: 6V3  Package: 0402  [CAP_0402]  (hidden comment: CAP - 0402)
C59  value 470nF  Voltage: 6V3  Package: 0402  [CAP_0402]  (hidden comment: CAP - 0402)
U7  XC6SLX100-3FGG676C  [FPGA_XILINX_FGG676]  (parts E,F of 10)

### Blocks framed on the sheet
Bank 4 - 1V8: U7
FPGA Bank 4 Decoupling Capacitors: C52-C55
Bank 5 - 3V3 (Unused): U7
FPGA Bank 5 Decoupling Capacitors: C56-C59

### Ports
DAC_CS# (out, see 16), DAC_IRQ# (in, see 16), DAC_RESET# (out, see 16), DAC_SCLK (out, see 16), DAC_SDIO (bidir, see 16), DAC_TXENABLE (out, see 16)

### Nets
1V8: C52.2 C53.2 C54.2 C55.2 U7.D2(VCCO_4) U7.F4(VCCO_4) U7.H2(VCCO_4) U7.J6(VCCO_4) U7.K4(VCCO_4) U7.M2(VCCO_4)
3V3D: C56.2 C57.2 C58.2 C59.2 U7.D25(VCCO_5) U7.F23(VCCO_5) U7.H25(VCCO_5) U7.J21(VCCO_5) U7.K23(VCCO_5) U7.M25(VCCO_5)
GND: C52.1 C53.1 C54.1 C55.1 C56.1 C57.1 C58.1 C59.1
DAC_CS#: U7.E3(IO_L77N_M4BA2_4) ; port DAC_CS#
DAC_IRQ#: U7.G6(IO_L78P_M4A10_4) ; port DAC_IRQ#
DAC_RESET#: U7.J10(IO_L76P_M4A7_4) ; port DAC_RESET#
DAC_SCLK: U7.K9(IO_L76N_M4A2_4) ; port DAC_SCLK
DAC_SDIO: U7.E4(IO_L77P_M4WE_4) ; port DAC_SDIO
DAC_TXENABLE: U7.G5(IO_L78N_M4A4_4) ; port DAC_TXENABLE

Not connected (* = marked no-connect by the designer): U7 A23(IO_L1N_A24_VREF_5) A25(IO_L10N_M5A1_5) B1(IO_L81N_M4A11_4) B2(IO_L81P_M4RESET_4) B23(IO_L1P_A25_5) B24(IO_L10P_M5A0_5) B25(IO_L12P_M5A3_5) B26(IO_L12N_M5ODT_5) C1(IO_L79N_M4A9_4) C2(IO_L79P_M4A8_4) C3(IO_L83N_VREF_4) C4(IO_L83P_4) C24(IO_L3N_M5A11_5) C25(IO_L11P_M5CLK_5) C26(IO_L11N_M5CLKN_5) D1(IO_L68N_M4DQ5_4) D3(IO_L68P_M4DQ4_4) D22(IO_L4N_M5A12_5) D23(IO_L3P_M5RESET_5) D24(IO_L17P_M5DQ6_5) D26(IO_L17N_M5DQ7_5) E1(IO_L67N_M4DQ7_4) E2(IO_L67P_M4DQ6_4) E5(IO_L80N_M4A12_4) E23(IO_L7P_M5WE_5) E24(IO_L7N_M5BA2_5) E25(IO_L16P_M5DQ4_5) E26(IO_L16N_M5DQ5_5) F1(IO_L66N_M4LDQSN_4) F3(IO_L66P_M4LDQS_4) F5(IO_L80P_M4CKE_4) F22(IO_L4P_M5CKE_5) F24(IO_L18P_M5LDQS_5) F26(IO_L18N_M5LDQSN_5) G1(IO_L65N_M4DQ3_4) G2(IO_L65P_M4DQ2_4) G3(IO_L73N_M4CLKN_4) G4(IO_L73P_M4CLK_4) G7(IO_L82N_M4A14_4) G19(IO_L9N_M5BA1_5) G20(IO_L2P_M5A13_5) G21(IO_L2N_M5A14_5) G22(IO_L6N_M5A4_5) G23(IO_L8P_M5A7_5) G24(IO_L8N_M5A2_5) G25(IO_L20P_M5DQ0_5) G26(IO_L20N_M5DQ1_5) H1(IO_L64N_M4DQ1_4) H3(IO_L64P_M4DQ0_4) H5(IO_L75N_M4BA1_4) H6(IO_L75P_M4BA0_4) H7(IO_L72N_M4ODT_4) H8(IO_L82P_M4A13_4) H18(IO_L9P_M5BA0_5) H19(IO_L27P_5) H20(IO_L5P_M5A8_5) H21(IO_L5N_M5A9_5) H22(IO_L6P_M5A10_5) H24(IO_L19P_M5DQ2_5) H26(IO_L19N_M5DQ3_5) J1(IO_L63N_M4DQ9_4) J2(IO_L63P_M4DQ8_4) J3(IO_L69N_M4LDM_4) J4(IO_L69P_M4UDM_4) J5(IO_L71N_M4A6_4) J7(IO_L72P_M4A3_4) J20(IO_L27N_5) J22(IO_L14N_M5CASN_5) J23(IO_L15P_M5UDM_5) J24(IO_L15N_M5LDM_5) J25(IO_L22P_M5DQ10_5) J26(IO_L22N_M5DQ11_5) K1(IO_L62N_M4DQ11_4) K3(IO_L62P_M4DQ10_4) K5(IO_L71P_M4A5_4) K6(IO_L70N_M4CASN_4) K7(IO_L70P_M4RASN_4) K8(IO_L58P_4) K10(IO_L74P_M4A0_4) K20(IO_L13P_M5A5_5) K21(IO_L13N_M5A6_5) K22(IO_L14P_M5RASN_5) K24(IO_L21P_M5DQ8_5) K26(IO_L21N_M5DQ9_5) L1(IO_L61N_M4UDQSN_4) L2(IO_L61P_M4UDQS_4) L8(IO_L58N_VREF_4) L9(IO_L74N_M4A1_4) L20(IO_L26P_5) L21(IO_L26N_VREF_5) L25(IO_L24P_M5DQ12_5) L26(IO_L24N_M5DQ13_5) M1(IO_L60N_M4DQ13_4) M3(IO_L60P_M4DQ12_4) M24(IO_L23P_M5UDQS_5) M26(IO_L23N_M5UDQSN_5) N1(IO_L59N_M4DQ15_4) N2(IO_L59P_M4DQ14_4) N25(IO_L25P_M5DQ14_5) N26(IO_L25N_M5DQ15_5)

### Notes on the sheet
- Current consumption
- Design notes:
  For all caps :
  Take X5R or X7R quality.
  ESL ranges 10 mOhm to 60mOhm
  Smaller values closer to FPGA
- 50mA @ VCCO_4 (1V8)
- 50mA @ VCCO_5 (3V3)
- Sheet Name
- Project Title
- Global Project
- Size
- Group
- Revision
- Date
- Sheet
- of
- Filename
- Designers
- (in symbol FPGA_XC6SLX100-3FGG676C, part E) BANK 4
- (in symbol FPGA_XC6SLX100-3FGG676C, part F) BANK 5

### Library data of the parts
C52 C56 = CAP - 1210: Precision: 10%; Current: *; CreatedBy: Jonathan Bouchard; Power: *
C53 C57 = CAP - 0805: Precision: 10%; Current: *; CreatedBy: Jonathan Bouchard; Power: *
C54 C55 C58 C59 = CAP - 0402: Precision: 10%; Current: *; CreatedBy: Jonathan Bouchard; Power: *
U7 = FPGA_XC6SLX100-3FGG676C: as U7 on sheet S7CAS-PLEIADES-CARTE-MERE_P07_FPGA_3; Current: *; Power: *; Mfg: Xilinx; Mfg Part Number: XC6SLX100-3FGG676C; HelpURL: https://www.xilinx.com/support/documentation/data_sheets/ds162.pdf; CreatedBy: Jonathan Bouchard; Temperature: 0°C ~ 85°C (TJ); Value: *; Precision: *; Package: BGA-676; Supplier 1: Digikey; Supplier Part Number 1: 122-1760-ND

## Sheet S7CAS-PLEIADES-CARTE-MERE_P07_FPGA_MISC.SchDoc
size Tabloid; DocumentNumber: 9; SheetNumber: 9; SheetTotal: 16; Sheet_Name: FPGA_MISC; Size: 11x17
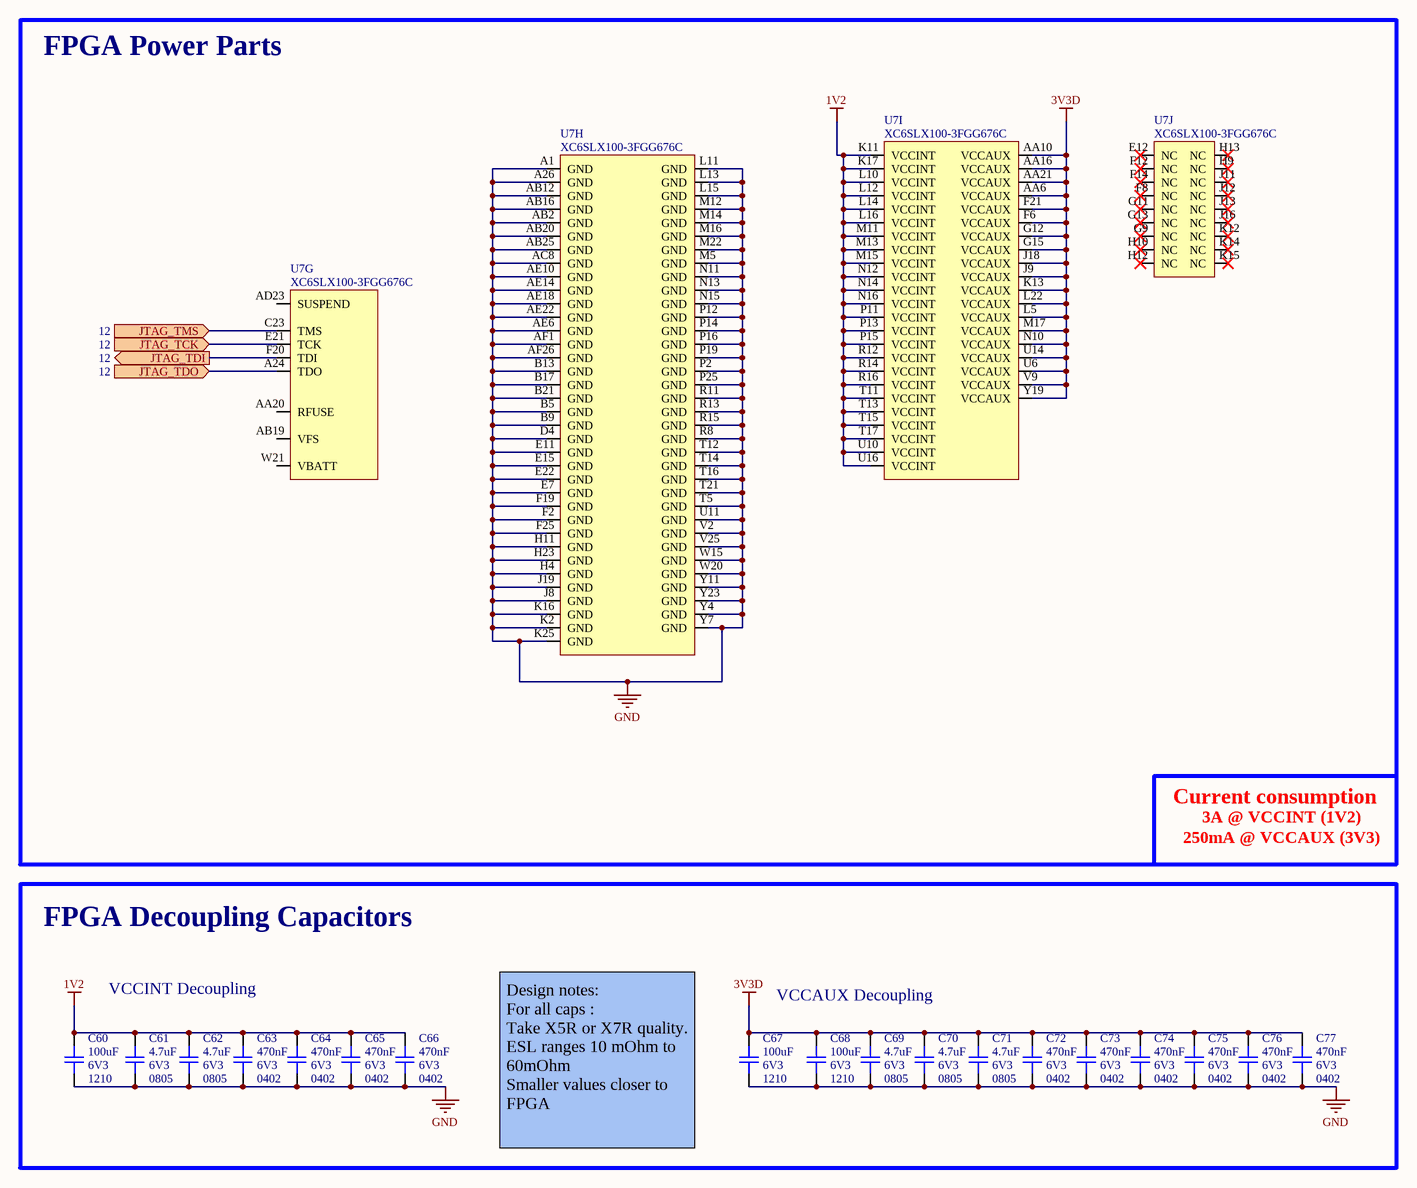
[diagram p8: S7CAS-PLEIADES-CARTE-MERE_P07_FPGA_MISC.SchDoc]

### Parts
C60  value 100uF  Voltage: 6V3  Package: 1210  [CAP_1210]  (hidden comment: CAP - 1210)
C61  value 4.7uF  Voltage: 6V3  Package: 0805  [CAP_0805]  (hidden comment: CAP - 0805)
C62  value 4.7uF  Voltage: 6V3  Package: 0805  [CAP_0805]  (hidden comment: CAP - 0805)
C63  value 470nF  Voltage: 6V3  Package: 0402  [CAP_0402]  (hidden comment: CAP - 0402)
C64  value 470nF  Voltage: 6V3  Package: 0402  [CAP_0402]  (hidden comment: CAP - 0402)
C65  value 470nF  Voltage: 6V3  Package: 0402  [CAP_0402]  (hidden comment: CAP - 0402)
C66  value 470nF  Voltage: 6V3  Package: 0402  [CAP_0402]  (hidden comment: CAP - 0402)
C67  value 100uF  Voltage: 6V3  Package: 1210  [CAP_1210]  (hidden comment: CAP - 1210)
C68  value 100uF  Voltage: 6V3  Package: 1210  [CAP_1210]  (hidden comment: CAP - 1210)
C69  value 4.7uF  Voltage: 6V3  Package: 0805  [CAP_0805]  (hidden comment: CAP - 0805)
C70  value 4.7uF  Voltage: 6V3  Package: 0805  [CAP_0805]  (hidden comment: CAP - 0805)
C71  value 4.7uF  Voltage: 6V3  Package: 0805  [CAP_0805]  (hidden comment: CAP - 0805)
C72  value 470nF  Voltage: 6V3  Package: 0402  [CAP_0402]  (hidden comment: CAP - 0402)
C73  value 470nF  Voltage: 6V3  Package: 0402  [CAP_0402]  (hidden comment: CAP - 0402)
C74  value 470nF  Voltage: 6V3  Package: 0402  [CAP_0402]  (hidden comment: CAP - 0402)
C75  value 470nF  Voltage: 6V3  Package: 0402  [CAP_0402]  (hidden comment: CAP - 0402)
C76  value 470nF  Voltage: 6V3  Package: 0402  [CAP_0402]  (hidden comment: CAP - 0402)
C77  value 470nF  Voltage: 6V3  Package: 0402  [CAP_0402]  (hidden comment: CAP - 0402)
U7  XC6SLX100-3FGG676C  [FPGA_XILINX_FGG676]  (parts G,H,I,J of 10)

### Blocks framed on the sheet
FPGA Power Parts: U7
FPGA Decoupling Capacitors: C60-C77

### Ports
JTAG_TCK (in, see 12), JTAG_TDI (out, see 12), JTAG_TDO (in, see 12), JTAG_TMS (in, see 12)

### Nets
1V2: C60.2 C61.2 C62.2 C63.2 C64.2 C65.2 C66.2 U7.K11(VCCINT) U7.K17(VCCINT) U7.L10(VCCINT) U7.L12(VCCINT) U7.L14(VCCINT) U7.L16(VCCINT) U7.M11(VCCINT) U7.M13(VCCINT) U7.M15(VCCINT) U7.N12(VCCINT) U7.N14(VCCINT) U7.N16(VCCINT) U7.P11(VCCINT) U7.P13(VCCINT) U7.P15(VCCINT) U7.R12(VCCINT) U7.R14(VCCINT) U7.R16(VCCINT) U7.T11(VCCINT) U7.T13(VCCINT) U7.T15(VCCINT) U7.T17(VCCINT) U7.U10(VCCINT) U7.U16(VCCINT)
3V3D: C67.2 C68.2 C69.2 C70.2 C71.2 C72.2 C73.2 C74.2 C75.2 C76.2 C77.2 U7.AA6(VCCAUX) U7.AA10(VCCAUX) U7.AA16(VCCAUX) U7.AA21(VCCAUX) U7.F6(VCCAUX) U7.F21(VCCAUX) U7.G12(VCCAUX) U7.G15(VCCAUX) U7.J9(VCCAUX) U7.J18(VCCAUX) U7.K13(VCCAUX) U7.L5(VCCAUX) U7.L22(VCCAUX) U7.M17(VCCAUX) U7.N10(VCCAUX) U7.U6(VCCAUX) U7.U14(VCCAUX) U7.V9(VCCAUX) U7.Y19(VCCAUX)
GND: C60.1 C61.1 C62.1 C63.1 C64.1 C65.1 C66.1 C67.1 C68.1 C69.1 C70.1 C71.1 C72.1 C73.1 C74.1 C75.1 C76.1 C77.1 U7.A1(GND) U7.A26(GND) U7.AB2(GND) U7.AB12(GND) U7.AB16(GND) U7.AB20(GND) U7.AB25(GND) U7.AC8(GND) U7.AE6(GND) U7.AE10(GND) U7.AE14(GND) U7.AE18(GND) U7.AE22(GND) U7.AF1(GND) U7.AF26(GND) U7.B5(GND) U7.B9(GND) U7.B13(GND) U7.B17(GND) U7.B21(GND) U7.D4(GND) U7.E7(GND) U7.E11(GND) U7.E15(GND) U7.E22(GND) U7.F2(GND) U7.F19(GND) U7.F25(GND) U7.H4(GND) U7.H11(GND) U7.H23(GND) U7.J8(GND) U7.J19(GND) U7.K2(GND) U7.K16(GND) U7.K25(GND) U7.L11(GND) U7.L13(GND) U7.L15(GND) U7.M5(GND) U7.M12(GND) U7.M14(GND) U7.M16(GND) U7.M22(GND) U7.N11(GND) U7.N13(GND) U7.N15(GND) U7.P2(GND) U7.P12(GND) U7.P14(GND) U7.P16(GND) U7.P19(GND) U7.P25(GND) U7.R8(GND) U7.R11(GND) U7.R13(GND) U7.R15(GND) U7.T5(GND) U7.T12(GND) U7.T14(GND) U7.T16(GND) U7.T21(GND) U7.U11(GND) U7.V2(GND) U7.V25(GND) U7.W15(GND) U7.W20(GND) U7.Y4(GND) U7.Y7(GND) U7.Y11(GND) U7.Y23(GND)
JTAG_TCK: U7.E21(TCK) ; port JTAG_TCK
JTAG_TDI: U7.F20(TDI) ; port JTAG_TDI
JTAG_TDO: U7.A24(TDO) ; port JTAG_TDO
JTAG_TMS: U7.C23(TMS) ; port JTAG_TMS

Not connected (* = marked no-connect by the designer): U7 AA20(RFUSE) AB19(VFS) AD23(SUSPEND) E12(NC)* F8(NC)* F12(NC)* F14(NC)* G9(NC)* G11(NC)* G13(NC)* H9(NC)* H10(NC)* H12(NC)* H13(NC)* J11(NC)* J12(NC)* J13(NC)* J16(NC)* K12(NC)* K14(NC)* K15(NC)* W21(VBATT)

### Notes on the sheet
- Current consumption
- 3A @ VCCINT (1V2)
- 250mA @ VCCAUX (3V3)
- VCCINT Decoupling
- VCCAUX Decoupling
- Design notes:
  For all caps :
  Take X5R or X7R quality.
  ESL ranges 10 mOhm to 60mOhm
  Smaller values closer to FPGA
- Sheet Name
- Project Title
- Global Project
- Size
- Group
- Revision
- Date
- Sheet
- of
- Filename
- Designers

### Library data of the parts
C60 C67 C68 = CAP - 1210: Precision: 10%; Current: *; CreatedBy: Jonathan Bouchard; Power: *
C61 C62 C69-C71 = CAP - 0805: Precision: 10%; Current: *; CreatedBy: Jonathan Bouchard; Power: *
C63-C66 C72-C77 = CAP - 0402: Precision: 10%; Current: *; CreatedBy: Jonathan Bouchard; Power: *
U7 = FPGA_XC6SLX100-3FGG676C: as U7 on sheet S7CAS-PLEIADES-CARTE-MERE_P07_FPGA_3; Current: *; Power: *; Mfg: Xilinx; Mfg Part Number: XC6SLX100-3FGG676C; HelpURL: https://www.xilinx.com/support/documentation/data_sheets/ds162.pdf; CreatedBy: Jonathan Bouchard; Temperature: 0°C ~ 85°C (TJ); Value: *; Precision: *; Package: BGA-676; Supplier 1: Digikey; Supplier Part Number 1: 122-1760-ND

## Sheet S7CAS-PLEIADES-CARTE-MERE_P07_CLOCK.SchDoc
size Tabloid; DocumentNumber: 10; SheetNumber: 10; SheetTotal: 16; Sheet_Name: CLOCK; Size: 11x17
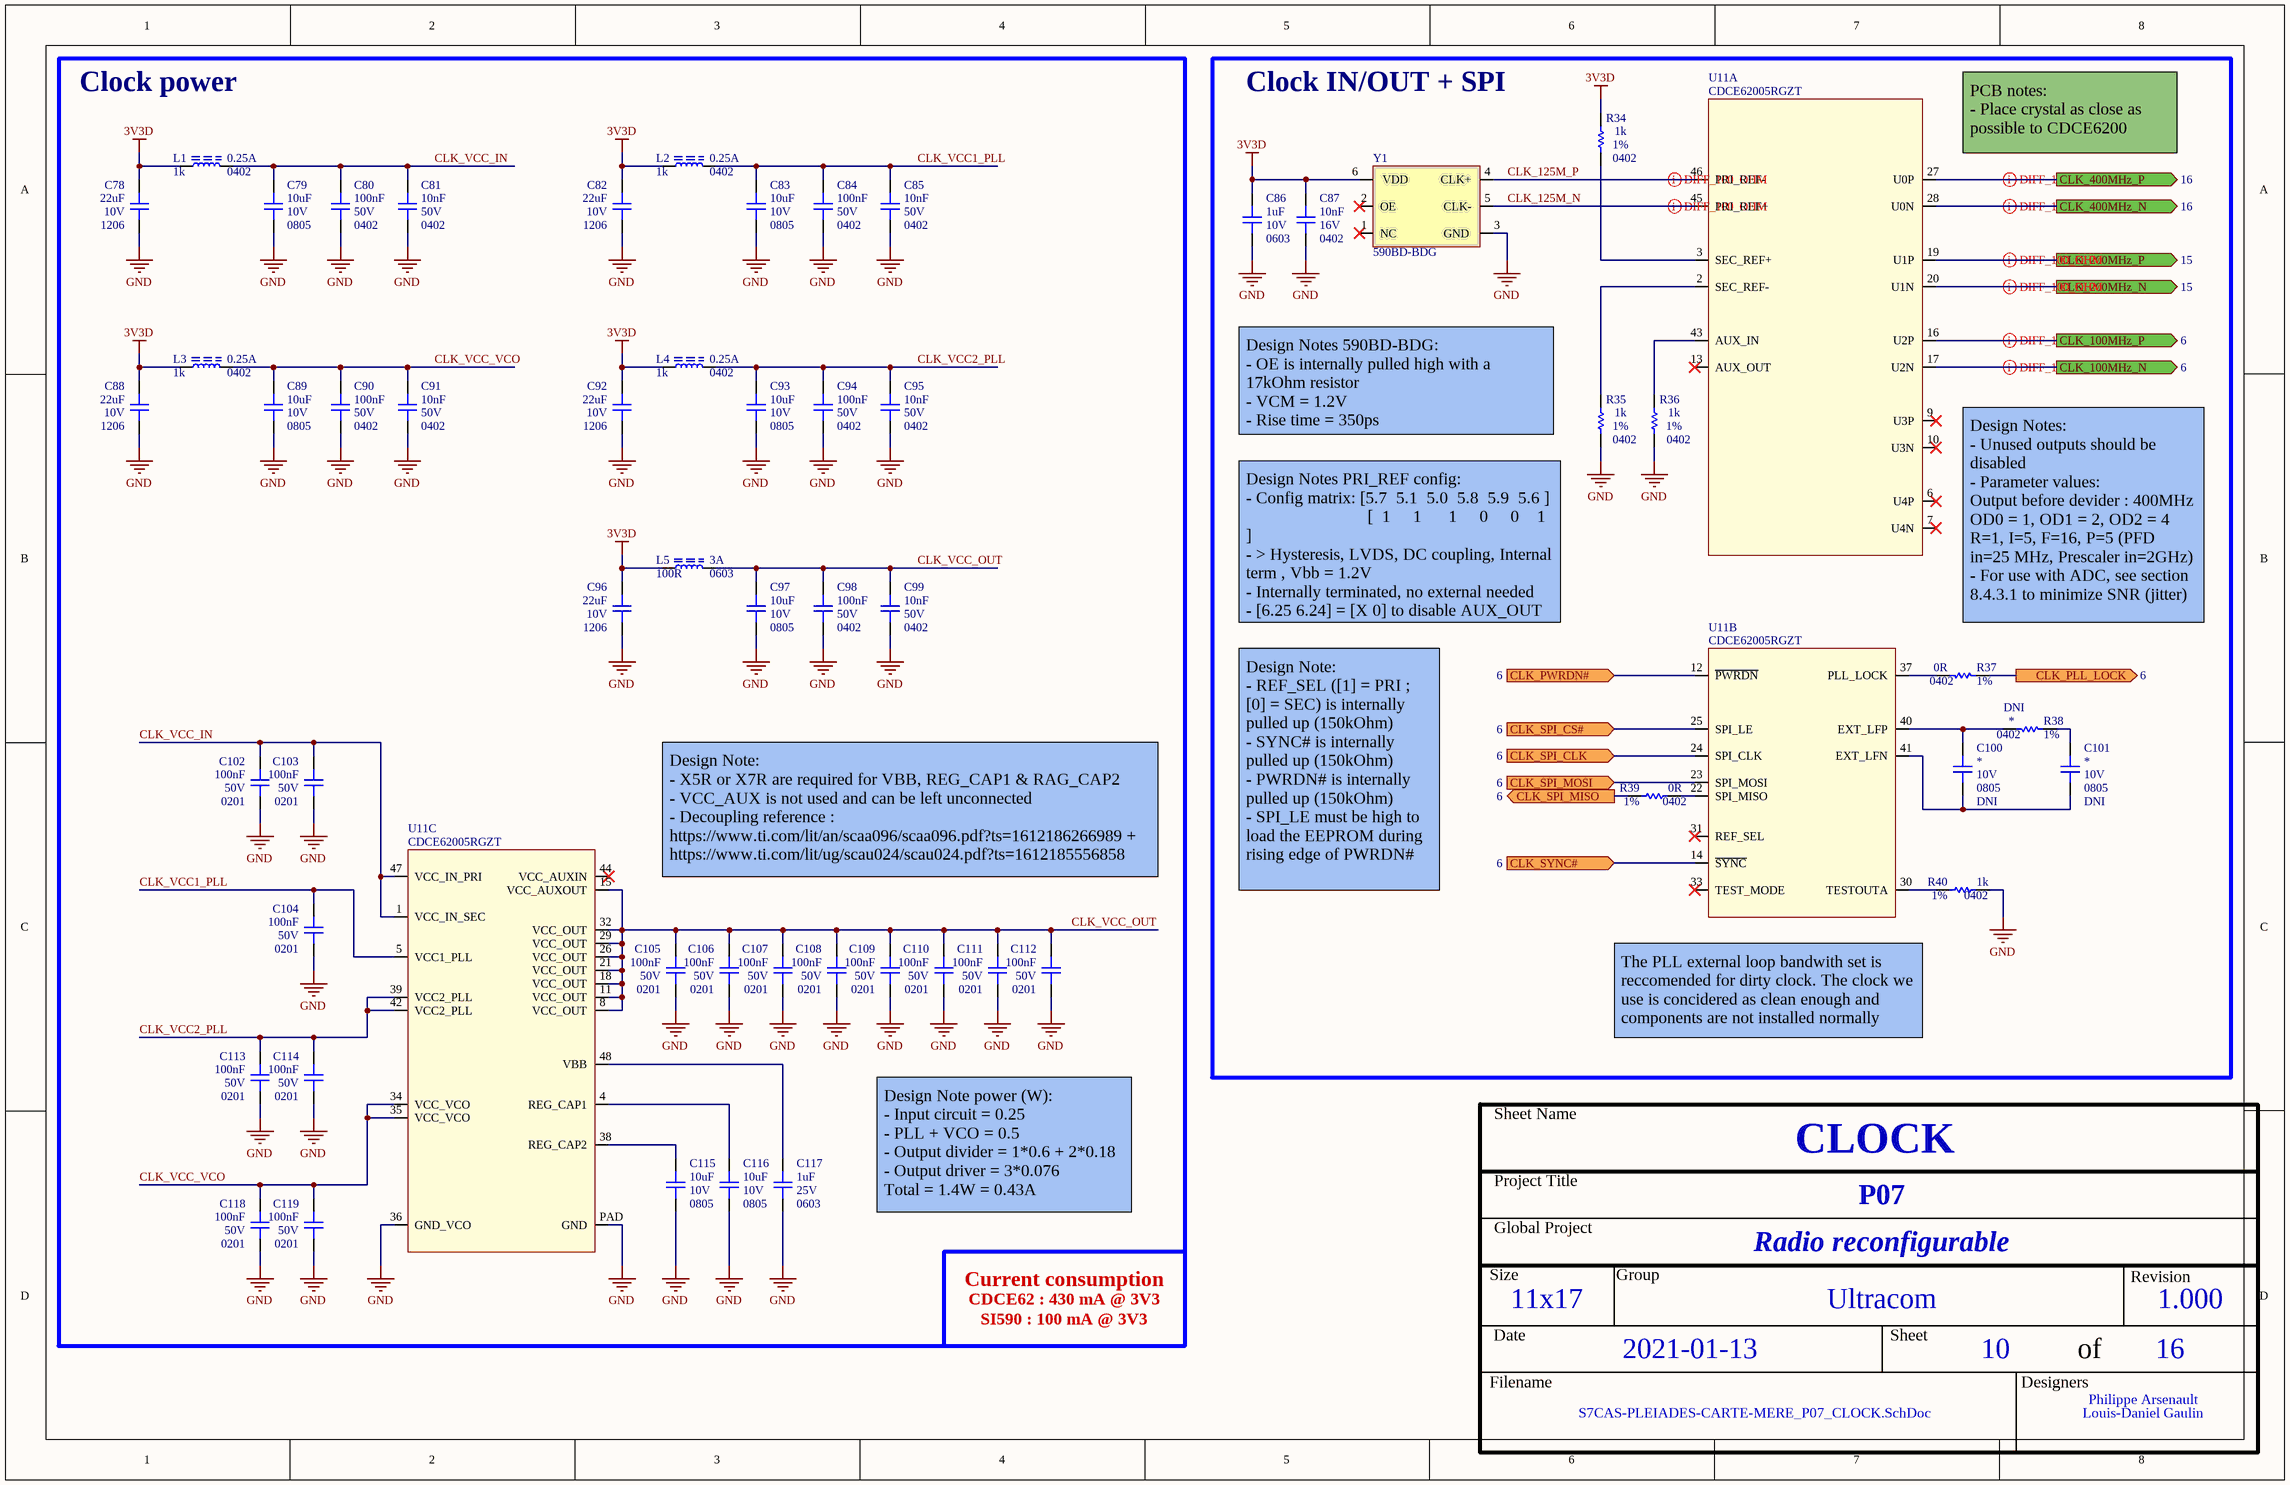
[diagram p9: S7CAS-PLEIADES-CARTE-MERE_P07_CLOCK.SchDoc]

### Parts
C78  value 22uF  Voltage: 10V  Package: 1206  [CAP_1206]  (hidden comment: CAP - 1206)
C79  value 10uF  Voltage: 10V  Package: 0805  [CAP_0805]  (hidden comment: CAP - 0805)
C80  value 100nF  Voltage: 50V  Package: 0402  [CAP_0402]  (hidden comment: CAP - 0402)
C81  value 10nF  Voltage: 50V  Package: 0402  [CAP_0402]  (hidden comment: CAP - 0402)
C82  value 22uF  Voltage: 10V  Package: 1206  [CAP_1206]  (hidden comment: CAP - 1206)
C83  value 10uF  Voltage: 10V  Package: 0805  [CAP_0805]  (hidden comment: CAP - 0805)
C84  value 100nF  Voltage: 50V  Package: 0402  [CAP_0402]  (hidden comment: CAP - 0402)
C85  value 10nF  Voltage: 50V  Package: 0402  [CAP_0402]  (hidden comment: CAP - 0402)
C86  value 1uF  Voltage: 10V  Package: 0603  [CAP_0603]  (hidden comment: CAP - 0603)
C87  value 10nF  Voltage: 16V  Package: 0402  [CAP_0402]  (hidden comment: CAP - 0402)
C88  value 22uF  Voltage: 10V  Package: 1206  [CAP_1206]  (hidden comment: CAP - 1206)
C89  value 10uF  Voltage: 10V  Package: 0805  [CAP_0805]  (hidden comment: CAP - 0805)
C90  value 100nF  Voltage: 50V  Package: 0402  [CAP_0402]  (hidden comment: CAP - 0402)
C91  value 10nF  Voltage: 50V  Package: 0402  [CAP_0402]  (hidden comment: CAP - 0402)
C92  value 22uF  Voltage: 10V  Package: 1206  [CAP_1206]  (hidden comment: CAP - 1206)
C93  value 10uF  Voltage: 10V  Package: 0805  [CAP_0805]  (hidden comment: CAP - 0805)
C94  value 100nF  Voltage: 50V  Package: 0402  [CAP_0402]  (hidden comment: CAP - 0402)
C95  value 10nF  Voltage: 50V  Package: 0402  [CAP_0402]  (hidden comment: CAP - 0402)
C96  value 22uF  Voltage: 10V  Package: 1206  [CAP_1206]  (hidden comment: CAP - 1206)
C97  value 10uF  Voltage: 10V  Package: 0805  [CAP_0805]  (hidden comment: CAP - 0805)
C98  value 100nF  Voltage: 50V  Package: 0402  [CAP_0402]  (hidden comment: CAP - 0402)
C99  value 10nF  Voltage: 50V  Package: 0402  [CAP_0402]  (hidden comment: CAP - 0402)
C100  Voltage: 10V  NI: DNI  Package: 0805  [CAP_0805]  (hidden comment: CAP - 0805)
C101  Voltage: 10V  NI: DNI  Package: 0805  [CAP_0805]  (hidden comment: CAP - 0805)
C102  value 100nF  Voltage: 50V  Package: 0201  [CAP_0201]  (hidden comment: CAP - 0201)
C103  value 100nF  Voltage: 50V  Package: 0201  [CAP_0201]  (hidden comment: CAP - 0201)
C104  value 100nF  Voltage: 50V  Package: 0201  [CAP_0201]  (hidden comment: CAP - 0201)
C105  value 100nF  Voltage: 50V  Package: 0201  [CAP_0201]  (hidden comment: CAP - 0201)
C106  value 100nF  Voltage: 50V  Package: 0201  [CAP_0201]  (hidden comment: CAP - 0201)
C107  value 100nF  Voltage: 50V  Package: 0201  [CAP_0201]  (hidden comment: CAP - 0201)
C108  value 100nF  Voltage: 50V  Package: 0201  [CAP_0201]  (hidden comment: CAP - 0201)
C109  value 100nF  Voltage: 50V  Package: 0201  [CAP_0201]  (hidden comment: CAP - 0201)
C110  value 100nF  Voltage: 50V  Package: 0201  [CAP_0201]  (hidden comment: CAP - 0201)
C111  value 100nF  Voltage: 50V  Package: 0201  [CAP_0201]  (hidden comment: CAP - 0201)
C112  value 100nF  Voltage: 50V  Package: 0201  [CAP_0201]  (hidden comment: CAP - 0201)
C113  value 100nF  Voltage: 50V  Package: 0201  [CAP_0201]  (hidden comment: CAP - 0201)
C114  value 100nF  Voltage: 50V  Package: 0201  [CAP_0201]  (hidden comment: CAP - 0201)
C115  value 10uF  Voltage: 10V  Package: 0805  [CAP_0805]  (hidden comment: CAP - 0805)
C116  value 10uF  Voltage: 10V  Package: 0805  [CAP_0805]  (hidden comment: CAP - 0805)
C117  value 1uF  Voltage: 25V  Package: 0603  [CAP_0603]  (hidden comment: CAP - 0603)
C118  value 100nF  Voltage: 50V  Package: 0201  [CAP_0201]  (hidden comment: CAP - 0201)
C119  value 100nF  Voltage: 50V  Package: 0201  [CAP_0201]  (hidden comment: CAP - 0201)
L1  value 1k  Current: 0.25A  Package: 0402  [FER_0402]  (hidden comment: FER - 0402)
L2  value 1k  Current: 0.25A  Package: 0402  [FER_0402]  (hidden comment: FER - 0402)
L3  value 1k  Current: 0.25A  Package: 0402  [FER_0402]  (hidden comment: FER - 0402)
L4  value 1k  Current: 0.25A  Package: 0402  [FER_0402]  (hidden comment: FER - 0402)
L5  value 100R  Current: 3A  Package: 0603  [FER_0603]  (hidden comment: FER - 0603)
R34  value 1k  Package: 0402  Precision: 1%  [RES_0402]  (hidden comment: RES - 0402)
R35  value 1k  Package: 0402  Precision: 1%  [RES_0402]  (hidden comment: RES - 0402)
R36  value 1k  Package: 0402  Precision: 1%  [RES_0402]  (hidden comment: RES - 0402)
R37  value 0R  Package: 0402  Precision: 1%  [RES_0402]  (hidden comment: RES - 0402)
R38  NI: DNI  Package: 0402  Precision: 1%  [RES_0402]  (hidden comment: RES - 0402)
R39  value 0R  Package: 0402  Precision: 1%  [RES_0402]  (hidden comment: RES - 0402)
R40  value 1k  Package: 0402  Precision: 1%  [RES_0402]  (hidden comment: RES - 0402)
U11  CDCE62005RGZT  [TIM_CDCE62005RGZT]  (parts A,B,C of 3)
Y1  590BD-BDG  [OSC_590BD-BDG]

### Blocks framed on the sheet
Clock power: C78-C85 C88-C99 C102-C119 L1-L5 U11
Clock IN/OUT + SPI: C86 C87 C100 C101 R34-R40 U11 Y1

### Ports
CLK_100MHz_N (out, see 6), CLK_100MHz_P (out, see 6), CLK_200MHz_N (out, see 15), CLK_200MHz_P (out, see 15), CLK_400MHz_N (out, see 16), CLK_400MHz_P (out, see 16), CLK_PLL_LOCK (out, see 6), CLK_PWRDN# (in, see 6), CLK_SPI_CLK (in, see 6), CLK_SPI_CS# (in, see 6), CLK_SPI_MISO (out, see 6), CLK_SPI_MOSI (in, see 6), CLK_SYNC# (in, see 6)

### Nets
3V3D: C78.2 C82.2 C86.2 C87.2 C88.2 C92.2 C96.2 L1.2 L2.2 L3.2 L4.2 L5.2 R34.2 Y1.6(VDD)
GND: C78.1 C79.1 C80.1 C81.1 C82.1 C83.1 C84.1 C85.1 C86.1 C87.1 C88.1 C89.1 C90.1 C91.1 C92.1 C93.1 C94.1 C95.1 C96.1 C97.1 C98.1 C99.1 C102.1 C103.1 C104.1 C105.1 C106.1 C107.1 C108.1 C109.1 C110.1 C111.1 C112.1 C113.1 C114.1 C115.1 C116.1 C117.1 C118.1 C119.1 R35.1 R36.1 R40.1 U11.36(GND_VCO) U11.PAD(GND) Y1.3(GND)
CLK_100MHz_N: U11.17(U2N) ; port CLK_100MHz_N
CLK_100MHz_P: U11.16(U2P) ; port CLK_100MHz_P
CLK_125M_N: U11.45(PRI_REF+) Y1.5(CLK-)
CLK_125M_P: U11.46(PRI_REF-) Y1.4(CLK+)
CLK_200MHz_N: U11.20(U1N) ; port CLK_200MHz_N
CLK_200MHz_P: U11.19(U1P) ; port CLK_200MHz_P
CLK_400MHz_N: U11.28(U0N) ; port CLK_400MHz_N
CLK_400MHz_P: U11.27(U0P) ; port CLK_400MHz_P
CLK_PLL_LOCK: R37.2 ; port CLK_PLL_LOCK
CLK_PWRDN#: U11.12(~{PWRDN}) ; port CLK_PWRDN#
CLK_SPI_CLK: U11.24(SPI_CLK) ; port CLK_SPI_CLK
CLK_SPI_CS#: U11.25(SPI_LE) ; port CLK_SPI_CS#
CLK_SPI_MISO: R39.2 ; port CLK_SPI_MISO
CLK_SPI_MOSI: U11.23(SPI_MOSI) ; port CLK_SPI_MOSI
CLK_SYNC#: U11.14(~{SYNC}) ; port CLK_SYNC#
CLK_VCC1_PLL: C83.2 C84.2 C85.2 C104.2 L2.1 U11.5(VCC1_PLL)
CLK_VCC2_PLL: C93.2 C94.2 C95.2 C113.2 C114.2 L4.1 U11.39(VCC2_PLL) U11.42(VCC2_PLL)
CLK_VCC_IN: C79.2 C80.2 C81.2 C102.2 C103.2 L1.1 U11.1(VCC_IN_SEC) U11.47(VCC_IN_PRI)
CLK_VCC_OUT: C97.2 C98.2 C99.2 C105.2 C106.2 C107.2 C108.2 C109.2 C110.2 C111.2 C112.2 L5.1 U11.8(VCC_OUT) U11.11(VCC_OUT) U11.15(VCC_AUXOUT) U11.18(VCC_OUT) U11.21(VCC_OUT) U11.26(VCC_OUT) U11.29(VCC_OUT) U11.32(VCC_OUT)
CLK_VCC_VCO: C89.2 C90.2 C91.2 C118.2 C119.2 L3.1 U11.34(VCC_VCO) U11.35(VCC_VCO)
NetC100_1: C100.1 C101.1 U11.41(EXT_LFN)
NetC100_2: C100.2 R38.1 U11.40(EXT_LFP)
NetC101_2: C101.2 R38.2
NetC115_2: C115.2 U11.38(REG_CAP2)
NetC116_2: C116.2 U11.4(REG_CAP1)
NetC117_2: C117.2 U11.48(VBB)
NetR34_1: R34.1 U11.3(SEC_REF+)
NetR35_2: R35.2 U11.2(SEC_REF-)
NetR36_2: R36.2 U11.43(AUX_IN)
NetR37_1: R37.1 U11.37(PLL_LOCK)
NetR39_1: R39.1 U11.22(SPI_MISO)
NetR40_2: R40.2 U11.30(TESTOUTA)

Not connected (* = marked no-connect by the designer): U11 6(U4P)* 7(U4N)* 9(U3P)* 10(U3N)* 13(AUX_OUT)* 31(REF_SEL)* 33(TEST_MODE)* 44(VCC_AUXIN)*; Y1 1(NC)* 2(OE)*

### Layout directives
differential pair; net class DIFF_100_OHM: CLK_100MHz_N, CLK_100MHz_P, CLK_125M_N, CLK_125M_P, CLK_200MHz_N, CLK_200MHz_P, CLK_400MHz_N, CLK_400MHz_P

### Notes on the sheet
- (near U11) PCB notes:
  - Place crystal as close as possible to CDCE6200
- (near R35) Design Notes 590BD-BDG:
  - OE is internally pulled high with a 17kOhm resistor
  - VCM = 1.2V
  - Rise time = 350ps
- (near R35) Design Notes PRI_REF config:
  - Config matrix: [5.7  5.1  5.0  5.8  5.9  5.6 ]
  [  1     1      1     0     0    1  ]
  - > Hysteresis, LVDS, DC coupling, Internal term , Vbb = 1.2V
  - Internally terminated, no external needed
  - [6.25 6.24] = [X 0] to disable AUX_OUT
- Design Notes:
  - Unused outputs should be disabled
  - Parameter values:
  Output before devider : 400MHz
  OD0 = 1, OD1 = 2, OD2 = 4
  R=1, I=5, F=16, P=5 (PFD in=25 MHz, Prescaler in=2GHz)
  - For use with ADC, see section 8.4.3.1 to minimize SNR (jitter)
- Design Note:
  - X5R or X7R are required for VBB, REG_CAP1 & RAG_CAP2
  - VCC_AUX is not used and can be left unconnected
  - Decoupling reference : https://www.ti.com/lit/an/scaa096/scaa096.pdf?ts=1612186266989 + https://www.ti.com/lit/ug/scau024/scau024.pdf?ts=1612185556858
- Design Note:
  - REF_SEL ([1] = PRI ; [0] = SEC) is internally pulled up (150kOhm)
  - SYNC# is internally pulled up (150kOhm)
  - PWRDN# is internally pulled up (150kOhm)
  - SPI_LE must be high to load the EEPROM during rising edge of PWRDN#
- The PLL external loop bandwith set is reccomended for dirty clock. The clock we use is concidered as clean enough and components are not installed normally
- Design Note power (W):
  - Input circuit = 0.25
  - PLL + VCO = 0.5
  - Output divider = 1*0.6 + 2*0.18
  - Output driver = 3*0.076
  Total = 1.4W = 0.43A
- CDCE62 : 430 mA @ 3V3
- Current consumption
- SI590 : 100 mA @ 3V3
- Sheet Name
- Project Title
- Global Project
- Size
- Group
- Revision
- Date
- Sheet
- of
- Filename
- Designers

### Library data of the parts
C78 C82 C88 C92 C96 = CAP - 1206: Precision: 10%; Current: *; CreatedBy: Jonathan Bouchard; Power: *
C79 C83 C89 C93 C97 C100 C101 C115 C116 = CAP - 0805: Mfg: CL21B106KPQNNNE; Precision: 10%; Current: *; CreatedBy: Jonathan Bouchard; Power: *
  C100 C101: Value: *
C80 C81 C84 C85 C87 C90 C91 C94 C95 C98 C99 = CAP - 0402: Precision: 10%; Current: *; CreatedBy: Jonathan Bouchard; Power: *
C86 = CAP - 0603: Precision: 10%; Current: *; CreatedBy: Jonathan Bouchard; Power: *
C102-C114 C118 C119 = CAP - 0201: Precision: 10%; Current: *; CreatedBy: Jonathan Bouchard; Power: *
C117 = CAP - 0603: Mfg Part Number: CC0603KRX5R8BB105; Precision: 10%; Current: *; CreatedBy: Jonathan Bouchard; Power: *
L1-L4 = FER - 0402: Mfg Part Number: BLM15HD102SN1D; Voltage: *; CreatedBy: Jonathan Bouchard; Power: *; Precision: *
L5 = FER - 0603: Mfg Part Number: BLM18KG101TN1D; Voltage: *; CreatedBy: Jonathan Bouchard; Power: *; Precision: *
R34-R40 = RES - 0402: Voltage: 50V; Power: 1/16W; Current: *; CreatedBy: Jonathan Bouchard
  R38: Value: *
U11 = TIM_CDCE62005RGZT: TIM - CLK SYNTH JITTER CLEANER 3:5 - QFN-48; Voltage: 3 V ~ 3.6 V; Mfg: Texas Instruments; Current: *; Power: *; Mfg Part Number: CDCE62005RGZT; HelpURL: http://www.ti.com/lit/ds/symlink/cdce62005.pdf; CreatedBy: Jonathan Bouchard; Temperature: -40°C ~ 85°C; Value: *; Precision: *; Package: QFN-48; Supplier 1: Digikey; Supplier Part Number 1: 296-23947-1-ND
Y1 = OSC_590BD-BDG: TIM - OSC PROG 125MHz ~ 214.999MHz LVDS 3.3V 7PPM EN/DS - 6-SMD; Manufacturer #1: Silicon Labs; Current Rating: 100 mA (supply); Note: Spécifié la fréquence lors de la commande; Voltage rating: 3.3V (supply); Polarized: Yes; Value: ±7ppm (freq Stability), ±20ppm (freq stability total); Magnetic Material: UNKNOWN; GRAMS Lib Spec: 2.8; Manufacturer #2: *; Power Max: *; Part Number #1: 590BD-BDG; Part Number #2: *; HelpURL: https://www.silabs.com/documents/public/data-sheets/Si590-591.pdf; Supplier 1: Digi-Key; Supplier Part Number 1: 590BD-BDG-ND; Assembly Type: SMD; Temperature: -40°C ~ 85°C; Package: 6-SMD; CreatedBy/Date: from 590BD-CDG; Tolerance: *; VerifiedBy: Caroline Paulin / 3/10/2019; Cryo: UNKNOWN